# Altium project PCB_Project.PrjPcb
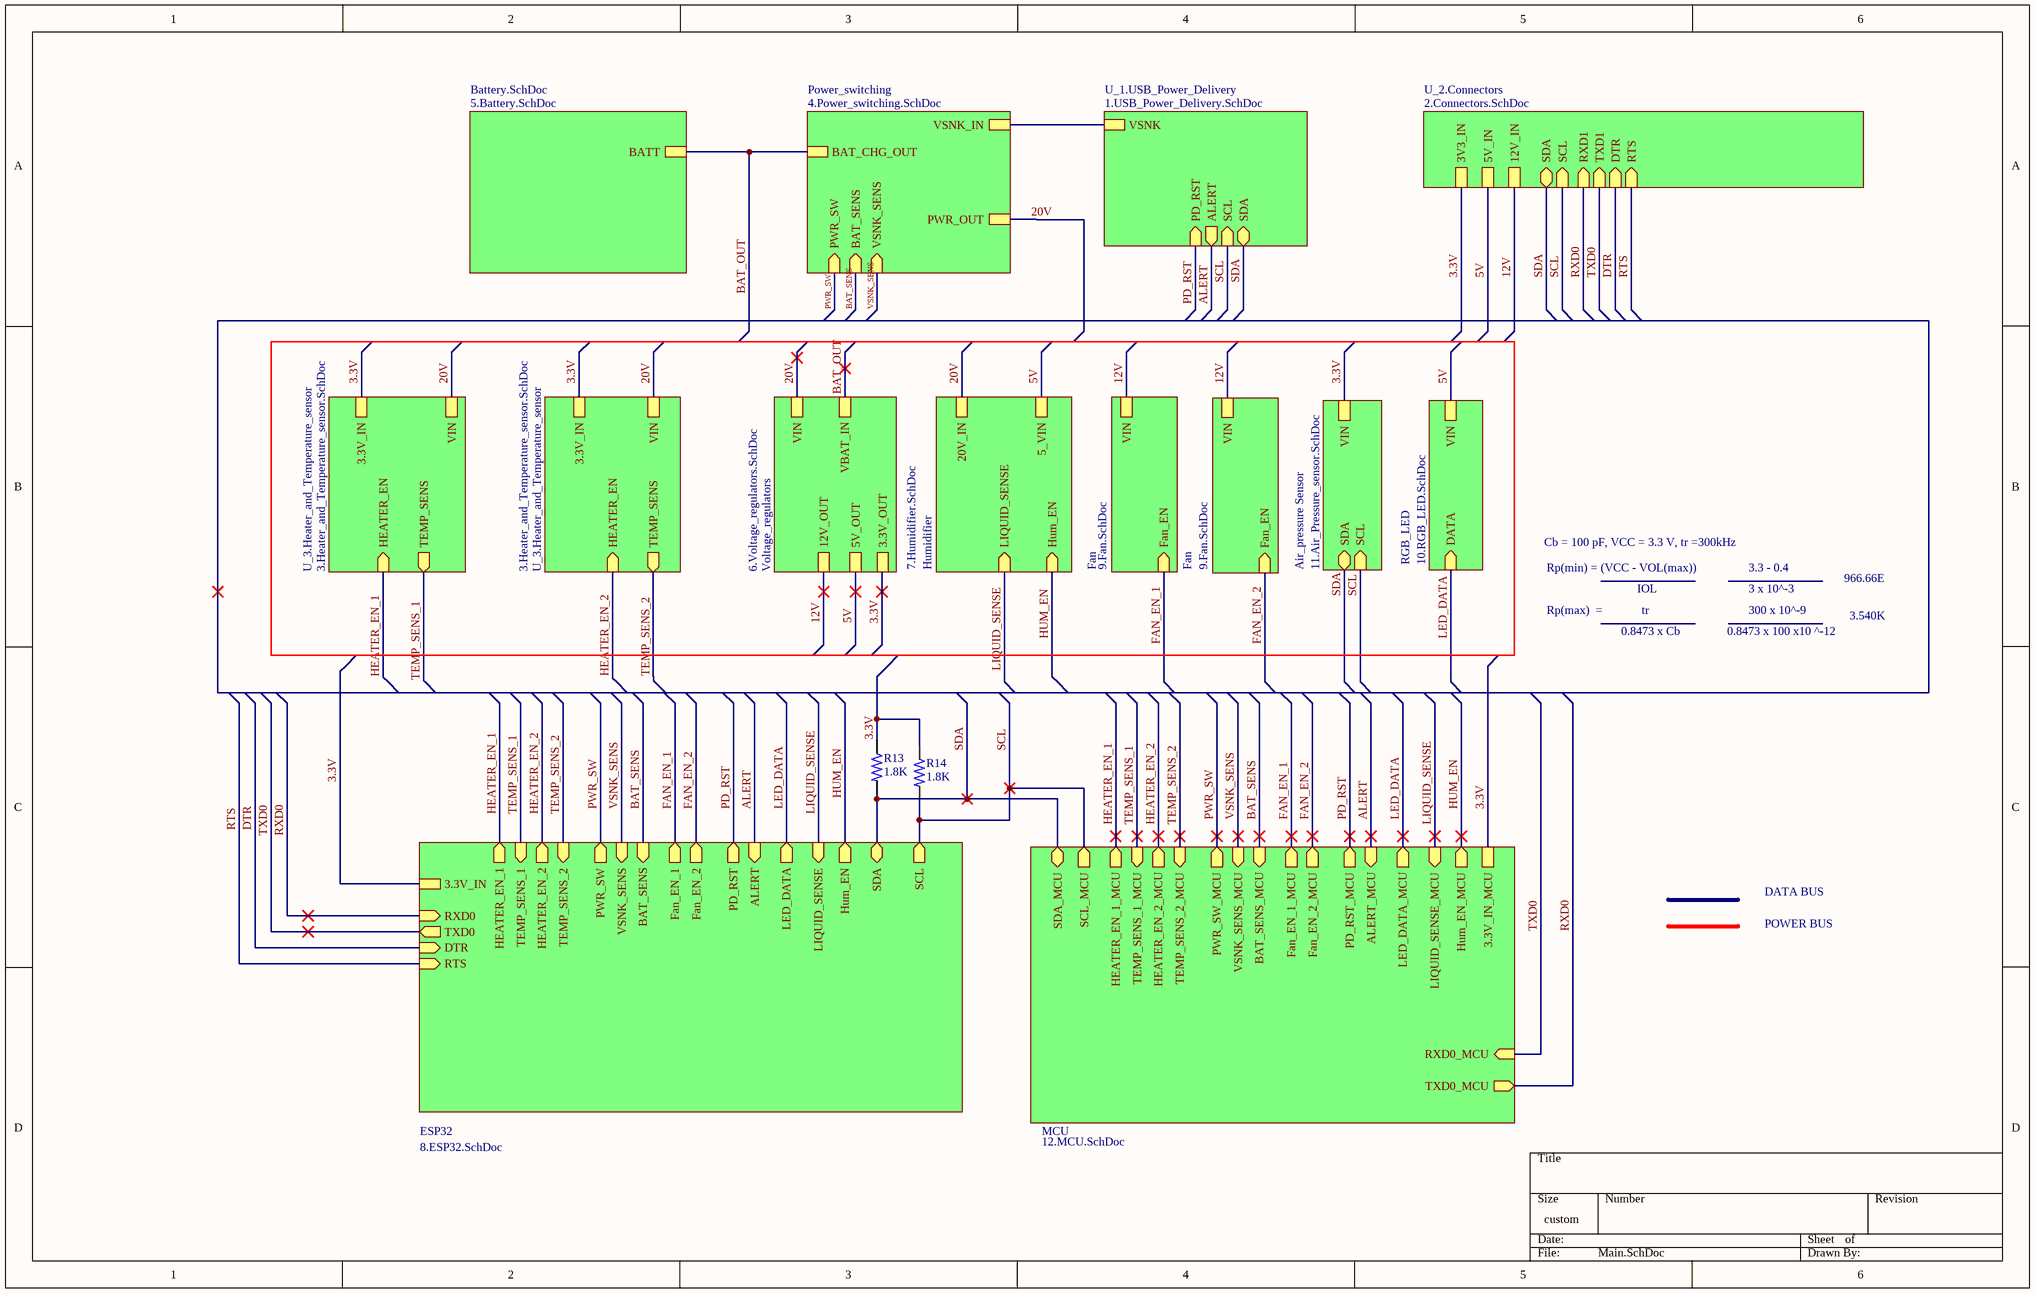
[diagram p0: Main.SchDoc]
13 sheets, 201 parts. Net scope: hierarchical (ports join the sheet entries above them; power ports are global).
Board file: PCB.PcbDoc
Sheets:
  Main.SchDoc
    U_1.USB_Power_Delivery = 1.USB_Power_Delivery.SchDoc
    U_2.Connectors = 2.Connectors.SchDoc
    U_3.Heater_and_Temperature_sensor = 3.Heater_and_Temperature_sensor.SchDoc
    U_3.Heater_and_Temperature_sensor = 3.Heater_and_Temperature_sensor.SchDoc
    Power_switching = 4.Power_switching.SchDoc
    Battery.SchDoc = 5.Battery.SchDoc
    Air_pressure Sensor = 11.Air_Pressure_sensor.SchDoc
    Humidifier = 7.Humidifier.SchDoc
    Fan = 9.Fan.SchDoc
    Voltage_regulators = 6.Voltage_regulators.SchDoc
    ESP32 = 8.ESP32.SchDoc
    RGB_LED = 10.RGB_LED.SchDoc
    Fan = 9.Fan.SchDoc
    MCU = 12.MCU.SchDoc

## Sheet Main.SchDoc
size 381 x 241 mm; SheetNumber: 1; SheetTotal: 13

### Parts
R13  1.8K  [R_0603]
R14  1.8K  [R_0603]

### Sub-sheets
Air_pressure Sensor = 11.Air_Pressure_sensor.SchDoc: VIN, SDA (bidir), SCL (in)
Battery.SchDoc = 5.Battery.SchDoc: BATT
ESP32 = 8.ESP32.SchDoc: SDA (bidir), SCL (out), 3.3V_IN, Hum_EN (out), RXD0 (in), TXD0 (out), DTR (in), RTS (in), HEATER_EN_1 (out), TEMP_SENS_1 (in), HEATER_EN_2 (out), TEMP_SENS_2 (in), LIQUID_SENSE (in), Fan_EN_1 (out), LED_DATA (out), Fan_EN_2 (out), PWR_SW (out), VSNK_SENS (in), BAT_SENS (in), PD_RST (out), ALERT (in)
Fan = 9.Fan.SchDoc: VIN, Fan_EN (in)
Fan = 9.Fan.SchDoc: VIN, Fan_EN (in)
Humidifier = 7.Humidifier.SchDoc: Hum_EN (in), 5_VIN, 20V_IN, LIQUID_SENSE (in)
MCU = 12.MCU.SchDoc: SDA_MCU (bidir), SCL_MCU (out), Hum_EN_MCU (out), HEATER_EN_2_MCU (out), TEMP_SENS_2_MCU (in), LIQUID_SENSE_MCU (in), Fan_EN_1_MCU (out), LED_DATA_MCU (out), Fan_EN_2_MCU (out), PWR_SW_MCU (out), VSNK_SENS_MCU (in), BAT_SENS_MCU (in), PD_RST_MCU (out), ALERT_MCU (in), RXD0_MCU (in), TXD0_MCU (out), 3.3V_IN_MCU, HEATER_EN_1_MCU (out), TEMP_SENS_1_MCU (in)
Power_switching = 4.Power_switching.SchDoc: PWR_OUT, VSNK_IN, BAT_CHG_OUT, PWR_SW (in), BAT_SENS (in), VSNK_SENS (in)
RGB_LED = 10.RGB_LED.SchDoc: DATA (in), VIN
U_1.USB_Power_Delivery = 1.USB_Power_Delivery.SchDoc: SDA (bidir), SCL (in), ALERT (out), PD_RST (in), VSNK
U_2.Connectors = 2.Connectors.SchDoc: SDA (bidir), SCL (in), RXD1 (in), TXD1 (in), DTR (in), RTS (in), 5V_IN, 3V3_IN, 12V_IN
U_3.Heater_and_Temperature_sensor = 3.Heater_and_Temperature_sensor.SchDoc: HEATER_EN (in), VIN, TEMP_SENS (out), 3.3V_IN
U_3.Heater_and_Temperature_sensor = 3.Heater_and_Temperature_sensor.SchDoc: HEATER_EN (in), VIN, TEMP_SENS (out), 3.3V_IN
Voltage_regulators = 6.Voltage_regulators.SchDoc: VIN, 3.3V_OUT, VBAT_IN, 5V_OUT, 12V_OUT

### Nets
3.3V: R13.1 R14.1 ; sheet U_2.Connectors/3V3_IN, sheet U_3.Heater_and_Temperature_sensor/3.3V_IN, sheet U_3.Heater_and_Temperature_sensor/3.3V_IN, sheet Air_pressure Sensor/VIN, sheet Voltage_regulators/3.3V_OUT, sheet ESP32/3.3V_IN, sheet MCU/3.3V_IN_MCU
5V: sheet U_2.Connectors/5V_IN, sheet Humidifier/5_VIN, sheet Voltage_regulators/5V_OUT, sheet RGB_LED/VIN
12V: sheet U_2.Connectors/12V_IN, sheet Fan/VIN, sheet Voltage_regulators/12V_OUT, sheet Fan/VIN
20V: sheet U_3.Heater_and_Temperature_sensor/VIN, sheet U_3.Heater_and_Temperature_sensor/VIN, sheet Power_switching/PWR_OUT, sheet Humidifier/20V_IN, sheet Voltage_regulators/VIN
ALERT: sheet U_1.USB_Power_Delivery/ALERT, sheet ESP32/ALERT, sheet MCU/ALERT_MCU
BAT_OUT: sheet Power_switching/BAT_CHG_OUT, sheet Battery.SchDoc/BATT, sheet Voltage_regulators/VBAT_IN
BAT_SENS: sheet Power_switching/BAT_SENS, sheet ESP32/BAT_SENS, sheet MCU/BAT_SENS_MCU
DTR: sheet U_2.Connectors/DTR, sheet ESP32/DTR
FAN_EN_1: sheet Fan/Fan_EN, sheet ESP32/Fan_EN_1, sheet MCU/Fan_EN_1_MCU
FAN_EN_2: sheet ESP32/Fan_EN_2, sheet Fan/Fan_EN, sheet MCU/Fan_EN_2_MCU
HEATER_EN_1: sheet U_3.Heater_and_Temperature_sensor/HEATER_EN, sheet ESP32/HEATER_EN_1, sheet MCU/HEATER_EN_1_MCU
HEATER_EN_2: sheet U_3.Heater_and_Temperature_sensor/HEATER_EN, sheet ESP32/HEATER_EN_2, sheet MCU/HEATER_EN_2_MCU
HUM_EN: sheet Humidifier/Hum_EN, sheet ESP32/Hum_EN, sheet MCU/Hum_EN_MCU
LED_DATA: sheet ESP32/LED_DATA, sheet RGB_LED/DATA, sheet MCU/LED_DATA_MCU
LIQUID_SENSE: sheet Humidifier/LIQUID_SENSE, sheet ESP32/LIQUID_SENSE, sheet MCU/LIQUID_SENSE_MCU
PD_RST: sheet U_1.USB_Power_Delivery/PD_RST, sheet ESP32/PD_RST, sheet MCU/PD_RST_MCU
PWR_SW: sheet Power_switching/PWR_SW, sheet ESP32/PWR_SW, sheet MCU/PWR_SW_MCU
RTS: sheet U_2.Connectors/RTS, sheet ESP32/RTS
RXD0: sheet U_2.Connectors/RXD1, sheet ESP32/RXD0, sheet MCU/TXD0_MCU
SCL: R14.2 ; sheet U_1.USB_Power_Delivery/SCL, sheet U_2.Connectors/SCL, sheet Air_pressure Sensor/SCL, sheet ESP32/SCL, sheet MCU/SCL_MCU
SDA: R13.2 ; sheet U_1.USB_Power_Delivery/SDA, sheet U_2.Connectors/SDA, sheet Air_pressure Sensor/SDA, sheet ESP32/SDA, sheet MCU/SDA_MCU
TEMP_SENS_1: sheet U_3.Heater_and_Temperature_sensor/TEMP_SENS, sheet ESP32/TEMP_SENS_1, sheet MCU/TEMP_SENS_1_MCU
TEMP_SENS_2: sheet U_3.Heater_and_Temperature_sensor/TEMP_SENS, sheet ESP32/TEMP_SENS_2, sheet MCU/TEMP_SENS_2_MCU
TXD0: sheet U_2.Connectors/TXD1, sheet ESP32/TXD0, sheet MCU/RXD0_MCU
VSNK_SENS: sheet Power_switching/VSNK_SENS, sheet ESP32/VSNK_SENS, sheet MCU/VSNK_SENS_MCU
NetJ1_2: sheet U_1.USB_Power_Delivery/VSNK, sheet Power_switching/VSNK_IN

### Notes on the sheet
- Cb = 100 pF, VCC = 3.3 V, tr =300kHz
- Rp(min) = (VCC - VOL(max))
- 3.3 - 0.4
- Rp(max)  =             tr
- 0.8473 x Cb
- IOL
- 0.8473 x 100 x10 ^-12
- 300 x 10^-9
- 3 x 10^-3
- 966.66E
- 3.540K
- DATA BUS
- POWER BUS

### Library data of the parts
R13 R14 = R_0603: D: *; MFR: *; P: *; PN: *; URL: *

## Sheet 1.USB_Power_Delivery.SchDoc
size B; ApprovedBy: Shijith Mohan; Author: Krishnawa; SheetNumber: 2; SheetTotal: 13
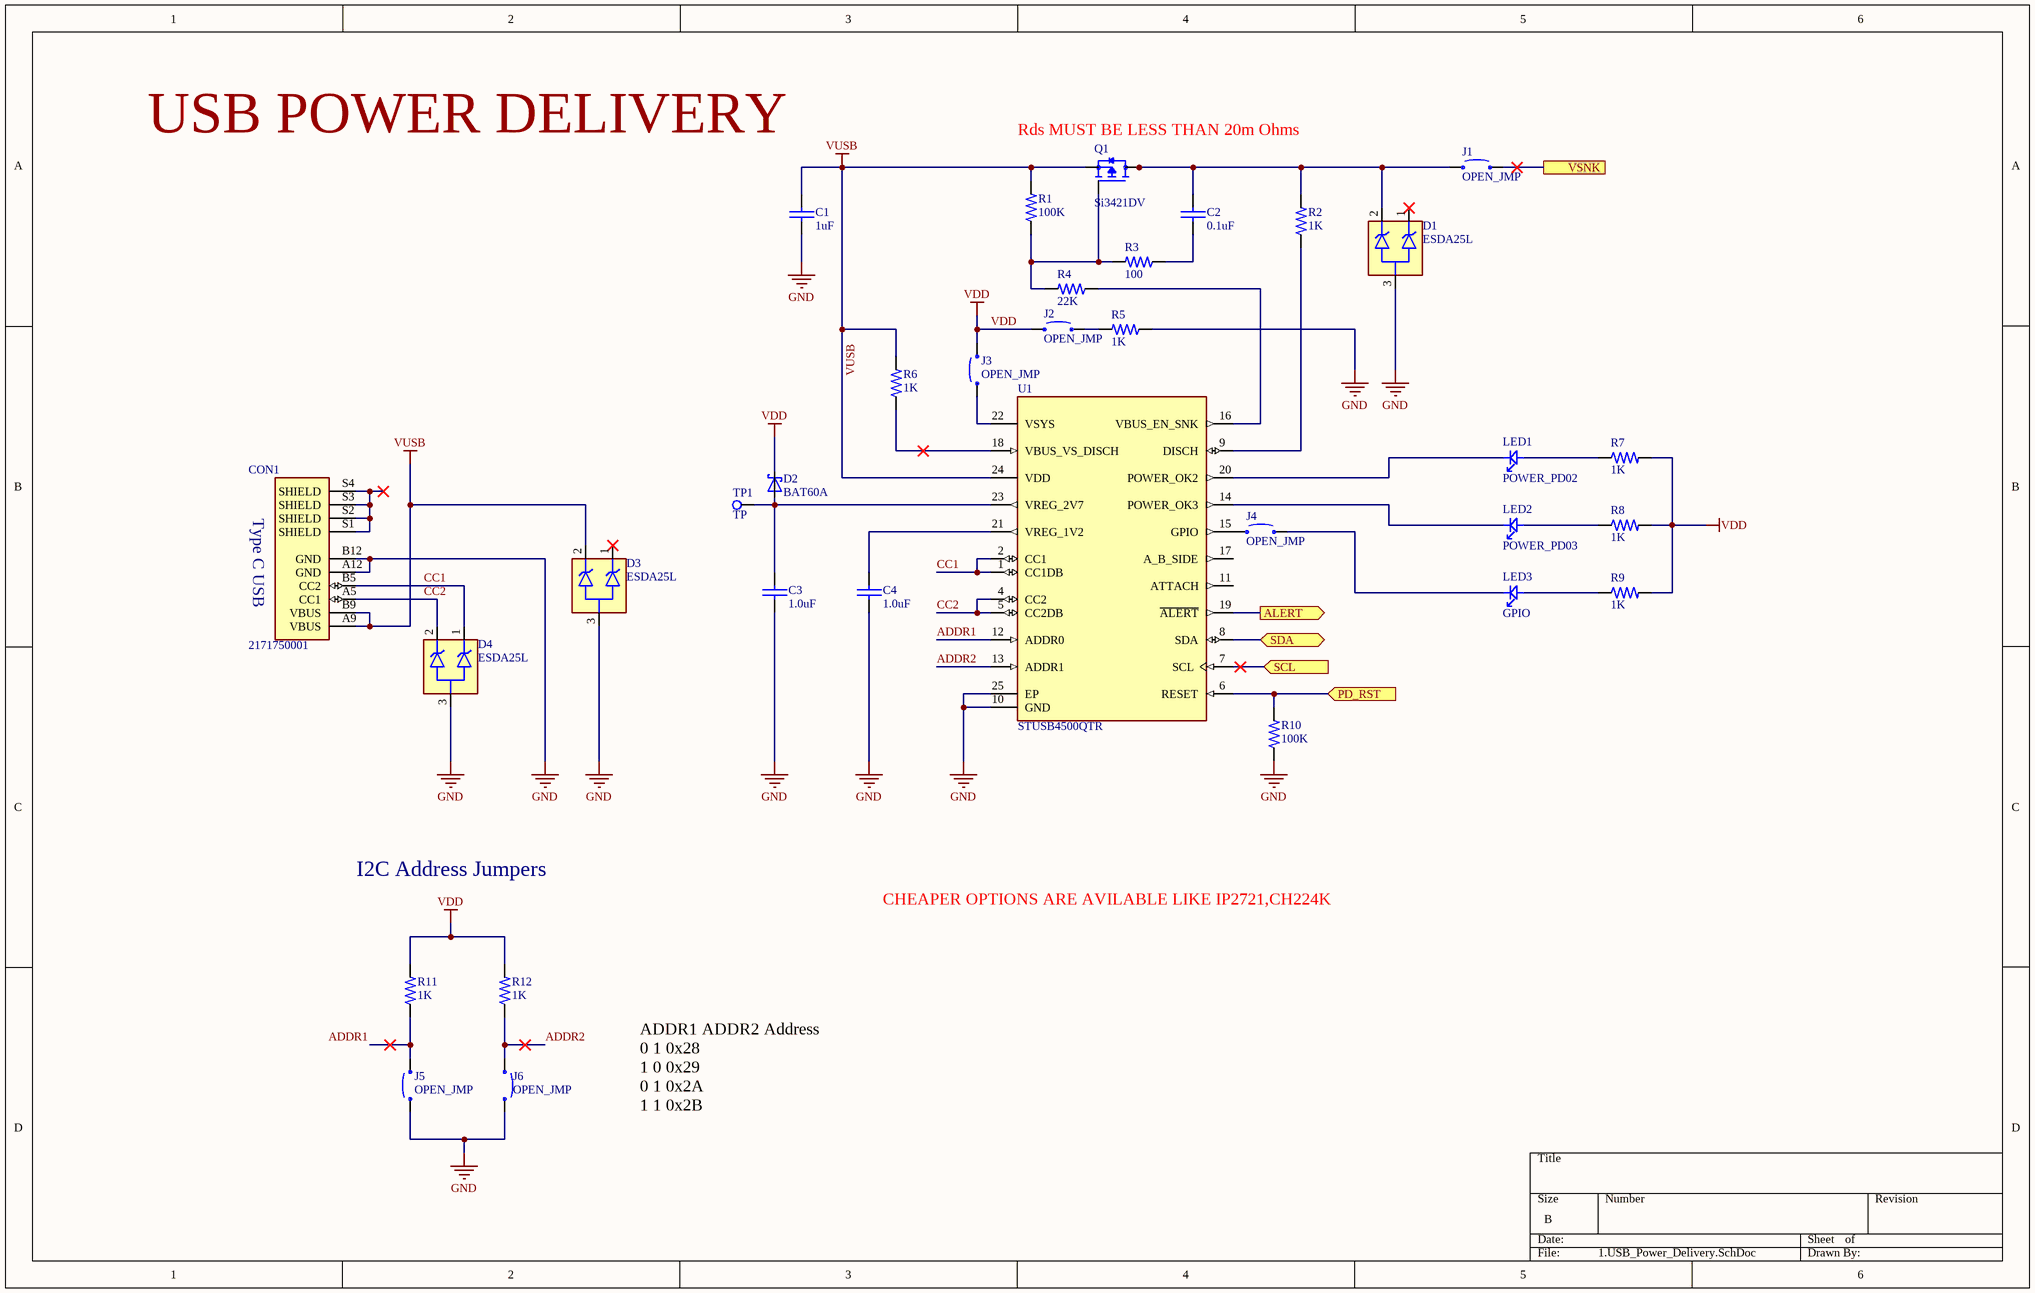
[diagram p1: 1.USB_Power_Delivery.SchDoc]

### Parts
C1  1uF  [C_0603]
C2  0.1uF  [C_0603]
C3  1.0uF  [C_0603]
C4  1.0uF  [C_0603]
CON1  2171750001  [217175-0001]
D1  ESDA25L  [SOT-23-3]
D2  BAT60A  [SOD-323]
D3  ESDA25L  [SOT-23-3]
D4  ESDA25L  [SOT-23-3]
J1  OPEN_JMP  [OPEN_JMP]
J2  OPEN_JMP  [OPEN_JMP]
J3  OPEN_JMP  [OPEN_JMP]
J4  OPEN_JMP  [OPEN_JMP]
J5  OPEN_JMP  [OPEN_JMP]
J6  OPEN_JMP  [OPEN_JMP]
LED1  POWER_PD02  [LED_0603]
LED2  POWER_PD03  [LED_0603]
LED3  GPIO  [LED_0603]
Q1  Si3421DV  [TSOP-6]
R1  100K  [R_0603]
R2  1K  [R_0603]
R3  100  [R_0603]
R4  22K  [R_0603]
R5  1K  [R_0603]
R6  1K  [R_0603]
R7  1K  [R_0603]
R8  1K  [R_0603]
R9  1K  [R_0603]
R10  100K  [R_0603]
R11  1K  [R_0603]
R12  1K  [R_0603]
TP1  TP  [TP]
U1  STUSB4500QTR  [VFQFN-24]

### Ports
ALERT (out), PD_RST (in), SCL (in), SDA (bidir), VSNK

### Nets
GND: C1.1 C3.1 C4.1 CON1.A12(GND) CON1.B12(GND) D1.3(CA) D3.3(CA) D4.3(CA) J5.1 J6.1 R5.1 R10.1 U1.10(GND) U1.25(EP)  [project net VSS]
VDD: D2.C J2.1 J3.2 R7.2 R8.2 R9.2 R11.2 R12.2
VUSB: C1.2 CON1.A9(VBUS) CON1.B9(VBUS) D3.2(C2) Q1.4(S) R1.2 R6.2 U1.24(VDD)
ADDR1: J5.2 R11.1 U1.12(ADDR0)
ADDR2: J6.2 R12.1 U1.13(ADDR1)
ALERT: U1.19(~{ALERT}) ; port ALERT
CC1: CON1.B5(CC2) D4.1(C1) U1.1(CC1DB) U1.2(CC1)
CC2: CON1.A5(CC1) D4.2(C2) U1.4(CC2) U1.5(CC2DB)
PD_RST: R10.2 U1.6(RESET) ; port PD_RST
SCL: U1.7(SCL) ; port SCL
SDA: U1.8(SDA) ; port SDA
NetC2_1: C2.1 R3.1
NetC2_2: C2.2 D1.2(C2) J1.1 Q1.1(D) Q1.2(D) Q1.5(D) Q1.6(D) R2.2
NetC3_2: C3.2 D2.A TP1.1 U1.23(VREG_2V7)
NetC4_2: C4.2 U1.21(VREG_1V2)
NetCON1_S1: CON1.S1(SHIELD) CON1.S2(SHIELD) CON1.S3(SHIELD) CON1.S4(SHIELD)
NetJ1_2: J1.2 ; port VSNK
NetJ2_2: J2.2 R5.2
NetJ3_1: J3.1 U1.22(VSYS)
NetJ4_1: J4.1 U1.15(GPIO)
NetJ4_2: J4.2 LED3.K
NetLED1_A: LED1.A R7.1
NetLED1_K: LED1.K U1.20(POWER_OK2)
NetLED2_A: LED2.A R8.1
NetLED2_K: LED2.K U1.14(POWER_OK3)
NetLED3_A: LED3.A R9.1
NetQ1_3: Q1.3(G) R1.1 R3.2 R4.2
NetR2_1: R2.1 U1.9(DISCH)
NetR4_1: R4.1 U1.16(VBUS_EN_SNK)
NetR6_1: R6.1 U1.18(VBUS_VS_DISCH)

Not connected (* = marked no-connect by the designer): D1 1(C1)*; D3 1(C1)*; U1 11(ATTACH) 17(A_B_SIDE)

### Notes on the sheet
- USB POWER DELIVERY
- (near Q1) Rds MUST BE LESS THAN 20m Ohms
- I2C Address Jumpers
- CHEAPER OPTIONS ARE AVILABLE LIKE IP2721,CH224K
- ADDR1	ADDR2	Address
  0	1	0x28
  1	0	0x29
  0	1	0x2A
  1	1	0x2B
- (in symbol 2171750001) Type C USB

### Library data of the parts
C1-C4 = C_0603: D: *; MFR: *; P: *; PN: *; URL: *
CON1 = 2171750001: MFR: Molex; D: USB Connectors Top-Mnt SMT 6Ckt Type C Rec.; P: 6 Contact; PN: 217175-0001; URL: https://www.mouser.in/ProductDetail/Molex/217175-0001?qs=DRkmTr78QARWJMiqNnldSg%3D%3D
D1 D3 D4 = ESDA25L: MFR: STMicroelectronics; D: ESD Suppressors / TVS Diodes SUPPRESSOR; P: SOT23-3L; PN: ESDA25L; URL: https://www.mouser.in/ProductDetail/STMicroelectronics/ESDA25L?qs=%252BFmDY%2FmH7IYTgvQLXlr24g%3D%3D
D2 = BAT60A: PN: BAT60AE6327HTSA1; D: Schottky Diodes & Rectifiers 10 V 3000 mA; P: SOD-323; URL: https://www.mouser.in/ProductDetail/Infineon-Technologies/BAT60AE6327HTSA1?qs=OwbwYO03UsIW3Y2lCXbs8Q%3D%3D
LED1-LED3 = LED_0603: MFR: Wurth Elektronik; PN: 150060RS75000; D: Standard LEDs - SMD WL-SMCW SMDMono TpVw Waterclr 0603 Red; P: 0603; YRL: https://www.mouser.in/ProductDetail/Wurth-Elektronik/150060RS75000?qs=LlUlMxKIyB3QnmZ3fw%2FVCA%3D%3D
Q1 = Si3421DV: MFR: Vishay Siliconix; D: P-Channel 30 V (D-S) MOSFET; PN: SI3421DV-T1-GE3; P: TSOP-6; URL: https://www.mouser.in/ProductDetail/Vishay-Semiconductors/SI3421DV-T1-GE3?qs=dpt6vIvaxwjvmZPXyyVpRg%3D%3D
R1-R12 = R_0603: D: *; MFR: *; P: *; PN: *; URL: *
U1 = STUSB4500QTR: MFR: STMicroelectronics; D: USB Interface IC Standalone USB PD controller for power sinking devices; P: QFN-24; PN: STUSB4500QTR; URL: https://www.mouser.in/ProductDetail/STMicroelectronics/STUSB4500QTR?qs=wUXugUrL1qyQbYMSzG1ujg%3D%3D&gclid=CjwKCAiA7IGcBhA8EiwAFfUDsZkZhe45H6sb259SlrXLDhHuC3iFilUbHdwuboXJa3yG6M-NUEA8VhoC06YQAvD_BwE

## Sheet 2.Connectors.SchDoc
size A4; SheetNumber: 3; SheetTotal: 13
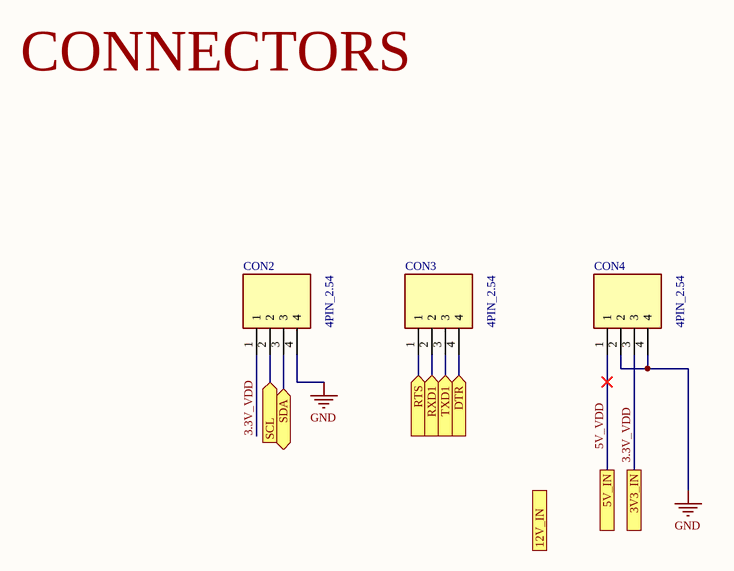
[diagram p2: 2.Connectors.SchDoc]

### Parts
CON2  4PIN_2.54  [4Pin_2.5]
CON3  4PIN_2.54  [4Pin_2.5]
CON4  4PIN_2.54  [4Pin_2.5]

### Ports
3V3_IN, 5V_IN, 12V_IN, DTR (in), RTS (in), RXD1 (in), SCL (in), SDA (bidir), TXD1 (in)

### Nets
GND: CON2.4 CON4.2 CON4.4  [project net VSS]
3.3V_VDD: CON2.1 CON4.3 ; port 3V3_IN  [project net 3.3V]
5V_VDD: CON4.1 ; port 5V_IN  [project net 5V]
DTR: CON3.4 ; port DTR
RTS: CON3.1 ; port RTS
RXD0: CON3.2 ; port RXD1
SCL: CON2.2 ; port SCL
SDA: CON2.3 ; port SDA
TXD0: CON3.3 ; port TXD1

### Notes on the sheet
- CONNECTORS

### Library data of the parts
CON2-CON4 = 4PIN_2.54: PN: 87224-4

## Sheet 3.Heater_and_Temperature_sensor.SchDoc
size A4; SheetNumber: 4; SheetTotal: 13
Used 2 times, as channels U_3.Heater_and_Temperature_sensor, U_3.Heater_and_Temperature_sensor. Parts and nets are listed once, with the designators drawn on the sheet.
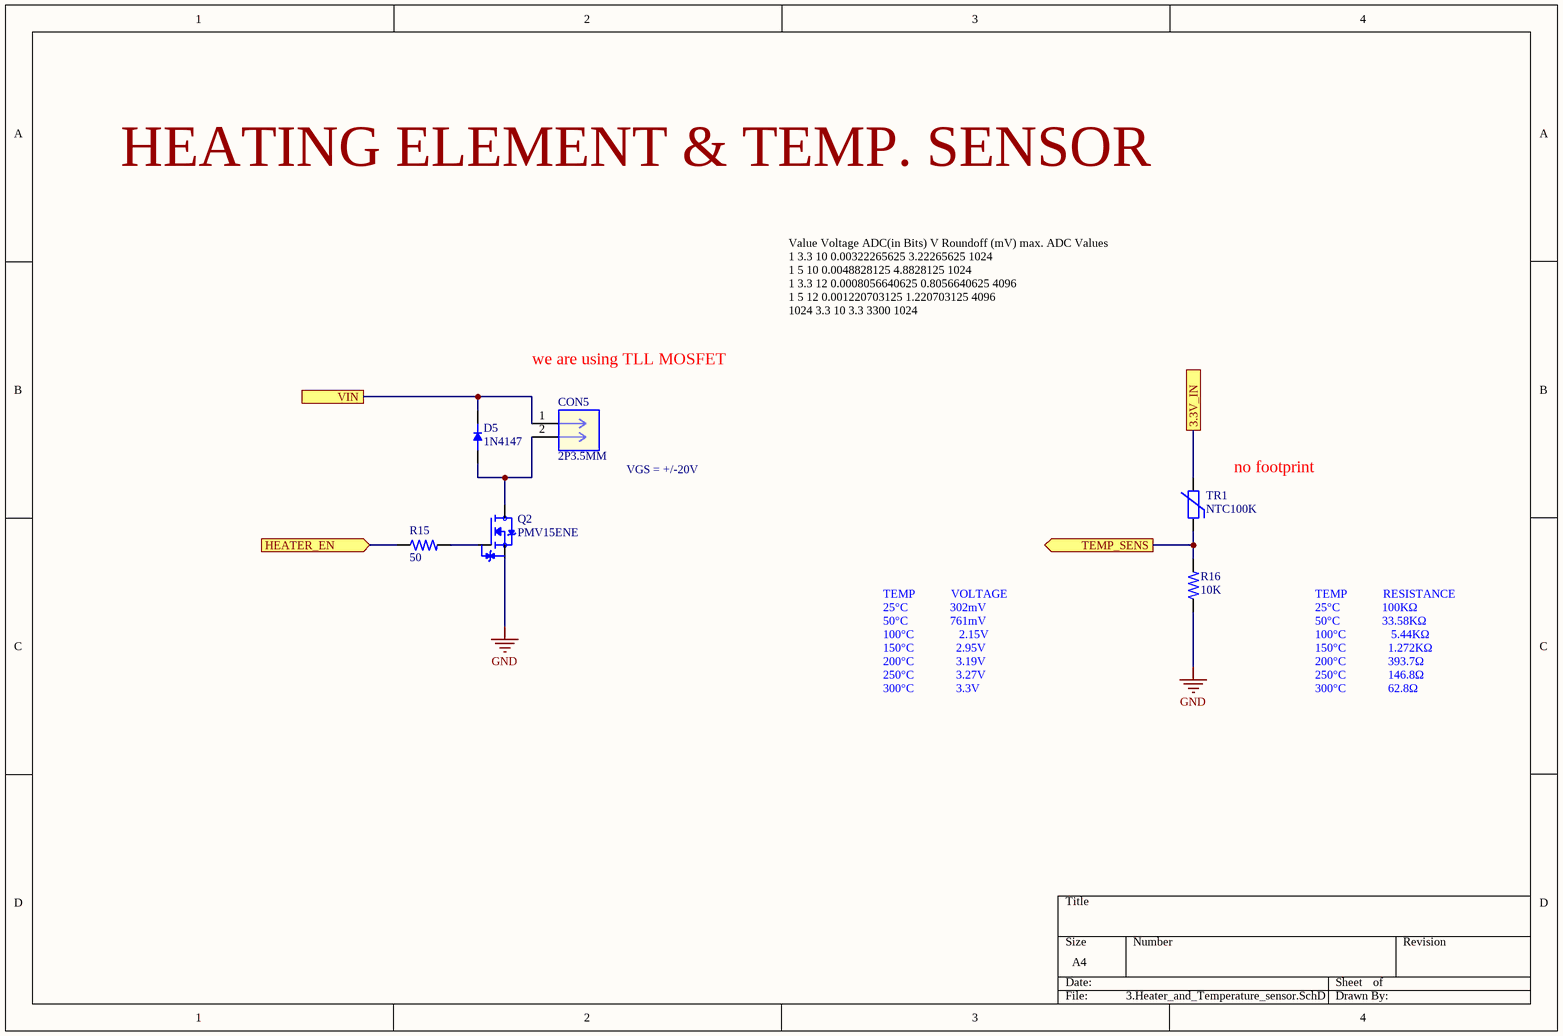
[diagram p3: 3.Heater_and_Temperature_sensor.SchDoc]

### Parts
CON5  2P3.5MM  [2P_P3.5mm]
D5  1N4147  [SOD123]
Q2  PMV15ENE  [SOT23FR]
R15  50  [R_0603]
R16  10K  [R_0603]
TR1  NTC100K

### Ports
3.3V_IN, HEATER_EN (in), TEMP_SENS (out), VIN

### Nets
GND: Q2.3(S) R16.1
3.3V_IN: TR1.1 ; port 3.3V_IN
HEATER_EN: R15.1 ; port HEATER_EN
TEMP_SENS: R16.2 TR1.2 ; port TEMP_SENS
VIN: CON5.1 D5.C(K) ; port VIN
NetCON5_2: CON5.2 D5.A Q2.1(D)
NetQ2_2: Q2.2(G) R15.2

### Channels
U_3.Heater_and_Temperature_sensor: designators end in A; ports 3.3V_IN=3.3V HEATER_EN=HEATER_EN_1 TEMP_SENS=TEMP_SENS_1 VIN=20V
U_3.Heater_and_Temperature_sensor: designators end in B; ports 3.3V_IN=3.3V HEATER_EN=HEATER_EN_2 TEMP_SENS=TEMP_SENS_2 VIN=20V

### Notes on the sheet
- HEATING ELEMENT & TEMP. SENSOR
- we are using TLL MOSFET
- Value	Voltage	ADC(in Bits)	V	Roundoff (mV)	max. ADC Values
  1	3.3	10	0.00322265625	3.22265625	1024
  1	5	10	0.0048828125	4.8828125	1024
  1	3.3	12	0.0008056640625	0.8056640625	4096
  1	5	12	0.001220703125	1.220703125	4096
  1024	3.3	10	3.3	3300	1024
- VGS = +/-20V
- (near TR1) no footprint
- TEMP	           VOLTAGE
  25°C	             302mV
  50°C	             761mV
  100°C 	             2.15V
  150°C	             2.95V
  200°C	             3.19V
  250°C	             3.27V
  300°C	             3.3V
- TEMP	           RESISTANCE
  25°C	             100KΩ
  50°C	             33.58KΩ
  100°C 	             5.44KΩ
  150°C	             1.272KΩ
  200°C	             393.7Ω
  250°C	             146.8Ω
  300°C	             62.8Ω

### Library data of the parts
CON5 = 2P3.5MM: MFR: Molex; D: Headers & Wire Housings 2CKT 3.5MM W TO B C KT 3.5MM W TO B CONN; PN: 53258-0229; URL: https://www.mouser.in/ProductDetail/Molex/53258-0229?qs=yYVs2tXBqMMxmAbgTccg5w%3D%3D
D5 = 1N4147: MFR: Panjit; PN: 1N4148W_R2_00001; D: Diodes - General Purpose, Power, Switching SURFACE MOUNT SWITCHING DIODES; P: SOD123; URL: https://www.mouser.in/ProductDetail/Panjit/1N4148W_R2_00001?qs=sPbYRqrBIVlsNrvmMQOkFA%3D%3D
Q2 = PMV15ENE: MFR: Nexperia; P: SOT-23-3; PN: PMV15ENER; D: MOSFET PMV15ENE/SOT23/TO-236AB; URL: https://www.mouser.in/ProductDetail/Nexperia/PMV15ENER?qs=Li%252BoUPsLEntpTHKsialBmQ%3D%3D
R15 R16 = R_0603: D: *; MFR: *; P: *; PN: *; URL: *
TR1 = NTC100K: MFR: Bussmann / Eaton; PN: NRBG105J4200B1J; D: NTC (Negative Temperature Coefficient) Thermistors Single ended, Glass NTC, 100K ohm, 4200 B; P: 2.54mm; URL: https://www.mouser.in/ProductDetail/Bussmann-Eaton/NRBG105J4200B1J?qs=doiCPypUmgEX7C7T9ljJrw%3D%3D

## Sheet 4.Power_switching.SchDoc
size A4; SheetNumber: 5; SheetTotal: 13
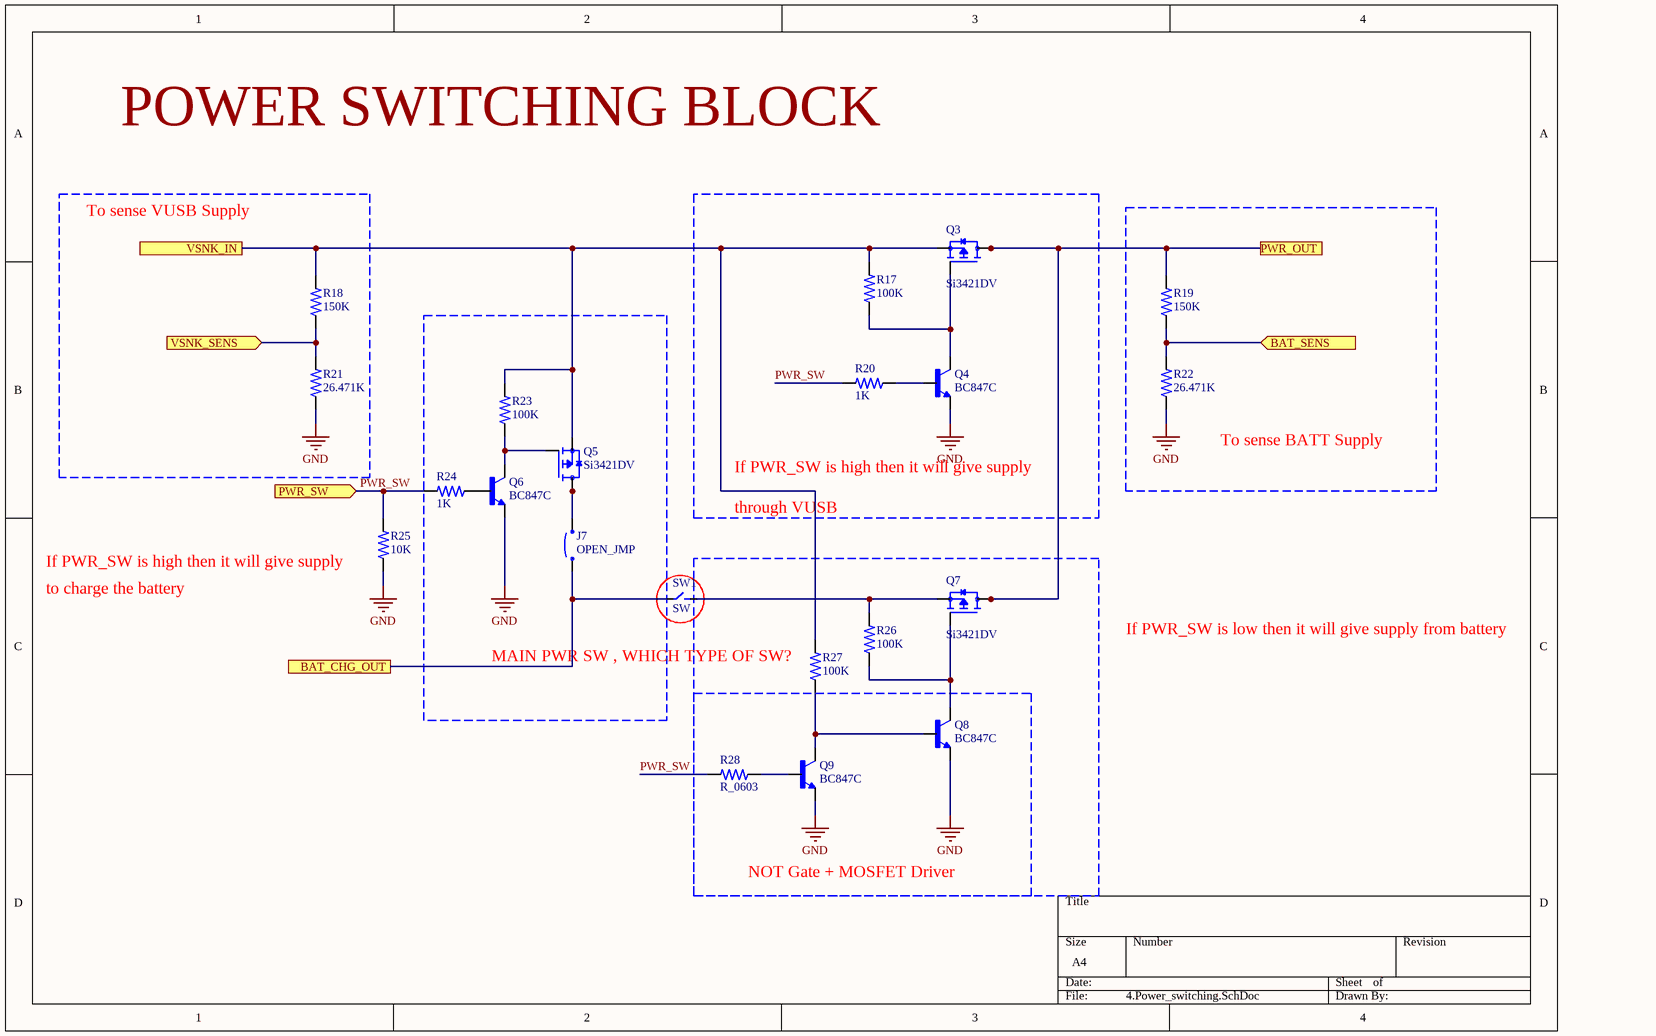
[diagram p4: 4.Power_switching.SchDoc]

### Parts
J7  OPEN_JMP  [OPEN_JMP]
Q3  Si3421DV  [TSOP-6]
Q4  BC847C  [SOT-23-3]
Q5  Si3421DV  [TSOP-6]
Q6  BC847C  [SOT-23-3]
Q7  Si3421DV  [TSOP-6]
Q8  BC847C  [SOT-23-3]
Q9  BC847C  [SOT-23-3]
R17  100K  [R_0603]
R18  150K  [R_0603]
R19  150K  [R_0603]
R20  1K  [R_0603]
R21  26.471K  [R_0603]
R22  26.471K  [R_0603]
R23  100K  [R_0603]
R24  1K  [R_0603]
R25  10K  [R_0603]
R26  100K  [R_0603]
R27  100K  [R_0603]
R28  R_0603  [R_0603]
SW1  SW

### Blocks framed on the sheet
To sense VUSB Supply: R18 R21
To sense BATT Supply: R19 R22
MAIN PWR SW , WHICH TYPE OF SW?: J7 Q5 Q6 R23 R24
NOT Gate + MOSFET Driver: Q8 Q9 R28

### Ports
BAT_CHG_OUT, BAT_SENS (in), PWR_OUT, PWR_SW (in), VSNK_IN, VSNK_SENS (in)

### Nets
GND: Q4.2(E) Q6.2(E) Q8.2(E) Q9.2(E) R21.1 R22.1 R25.1  [project net VSS]
20V: Q3.1(D) Q3.2(D) Q3.5(D) Q3.6(D) Q7.1(D) Q7.2(D) Q7.5(D) Q7.6(D) R19.2 ; port PWR_OUT
BAT_OUT: J7.1 SW1.1 ; port BAT_CHG_OUT
BAT_SENS: R19.1 R22.2 ; port BAT_SENS
PWR_SW: R20.2 R24.2 R25.2 R28.2 ; port PWR_SW
VSNK_SENS: R18.1 R21.2 ; port VSNK_SENS
NetJ1_2: Q3.4(S) Q5.4(S) R17.2 R18.2 R23.2 R27.2 ; port VSNK_IN
NetJ7_2: J7.2 Q5.1(D) Q5.2(D) Q5.5(D) Q5.6(D)
NetQ3_3: Q3.3(G) Q4.3(C) R17.1
NetQ4_1: Q4.1(B) R20.1
NetQ5_3: Q5.3(G) Q6.3(C) R23.1
NetQ6_1: Q6.1(B) R24.1
NetQ7_3: Q7.3(G) Q8.3(C) R26.1
NetQ7_4: Q7.4(S) R26.2 SW1.2
NetQ8_1: Q8.1(B) Q9.3(C) R27.1
NetQ9_1: Q9.1(B) R28.1

### Notes on the sheet
- POWER SWITCHING BLOCK
- If PWR_SW is high then it will give supply
- through VUSB
- (near R25) If PWR_SW is high then it will give supply
- to charge the battery
- If PWR_SW is low then it will give supply from battery

### Library data of the parts
Q3 Q5 Q7 = Si3421DV: as Q1 on sheet 1.USB_Power_Delivery; P: TSOP-6; URL: https://www.mouser.in/ProductDetail/Vishay-Semiconductors/SI3421DV-T1-GE3?qs=dpt6vIvaxwjvmZPXyyVpRg%3D%3D
Q4 Q6 Q8 Q9 = BC847C: MFR: Nexperia; D: Bipolar Transistors - BJT BC847C/SOT23/TO-236AB; PN: BC847C,215; P: SOT-23-3; URL: https://www.mouser.in/ProductDetail/Nexperia/BC847C215?qs=me8TqzrmIYVnv3C18%2Fxa3Q%3D%3D
R17-R27 = R_0603: D: *; MFR: *; P: *; PN: *; URL: *
R28 = R_0603: D: *; MFR: *; P: *; PN: *; URL: *

## Sheet 5.Battery.SchDoc
size A4; SheetNumber: 6; SheetTotal: 13
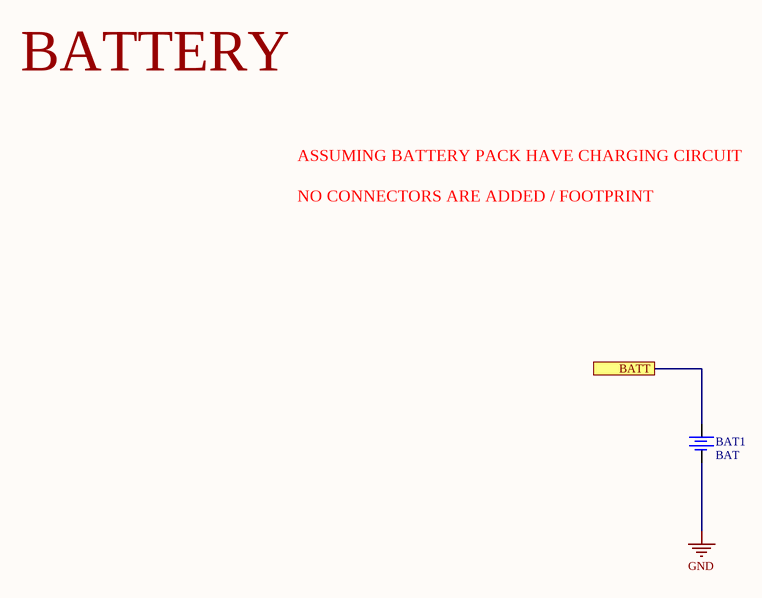
[diagram p5: 5.Battery.SchDoc]

### Parts
BAT1  BAT  [2P5mm_PITCH_COM]

### Ports
BATT

### Nets
GND: BAT1.1  [project net VSS]
BAT_OUT: BAT1.2 ; port BATT

### Notes on the sheet
- BATTERY
- ASSUMING BATTERY PACK HAVE CHARGING CIRCUIT
- NO CONNECTORS ARE ADDED / FOOTPRINT

## Sheet 11.Air_Pressure_sensor.SchDoc
size A4; SheetNumber: 12; SheetTotal: 13
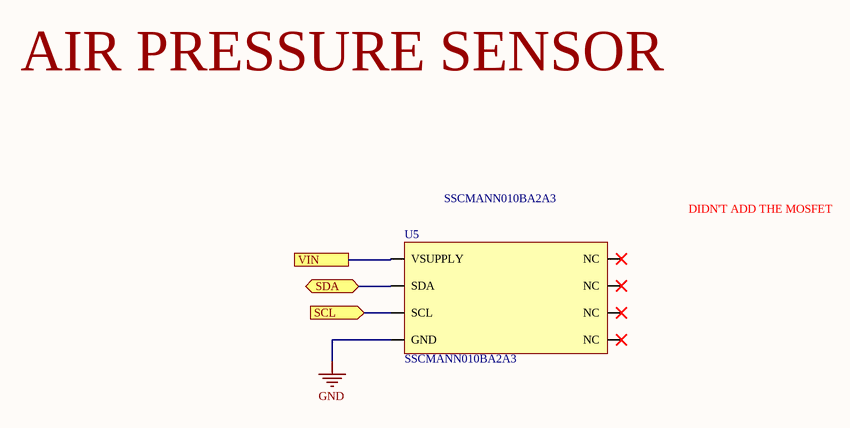
[diagram p6: 11.Air_Pressure_sensor.SchDoc]

### Parts
U5  SSCMANN010BA2A3  [SSCMANN010BA2A3]

### Ports
SCL (in), SDA (bidir), VIN

### Nets
GND: U5.1(GND)  [project net VSS]
3.3V: U5.2(VSUPPLY) ; port VIN
SCL: U5.4(SCL) ; port SCL
SDA: U5.3(SDA) ; port SDA

Not connected (* = marked no-connect by the designer): U5 5(NC)* 6(NC)* 7(NC)* 8(NC)*

### Notes on the sheet
- AIR PRESSURE SENSOR
- (near U5) SSCMANN010BA2A3
- DIDN'T ADD THE MOSFET

### Library data of the parts
U5 = SSCMANN010BA2A3: MFR: HONEYWELL; D: Board Mount Pressure Sensors; PN: SSCMANN010BA2A3; URL: https://www.mouser.in/ProductDetail/Honeywell/SSCMANN010BA2A3?qs=V2VaM7qhK8cLhmuNijeOKA%3D%3D

## Sheet 7.Humidifier.SchDoc
size A4; SheetNumber: 8; SheetTotal: 13
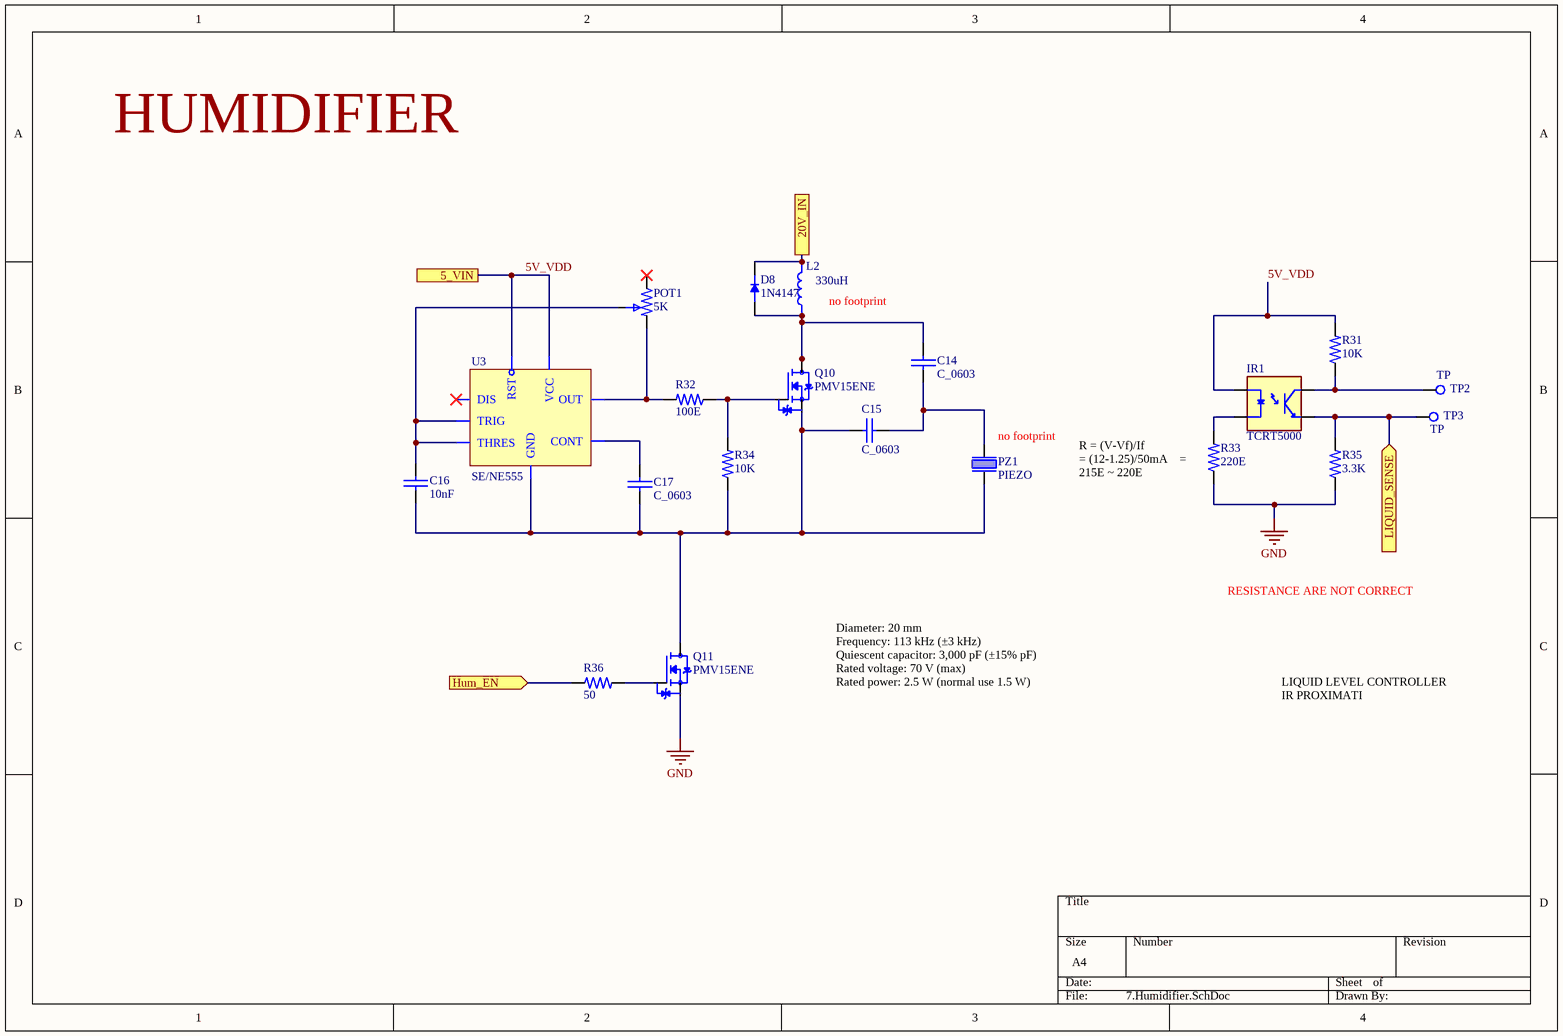
[diagram p7: 7.Humidifier.SchDoc]

### Parts
C14  C_0603  [C_0603]
C15  C_0603  [C_0603]
C16  10nF  [C_0603]
C17  C_0603  [C_0603]
D8  1N4147  [SOD123]
IR1  TCRT5000  [TCRT5000]
L2  330uH  [2P5mm_PITCH_COM]
POT1  5K  [TC33 - 3 mm SMD Trimpot]
PZ1  PIEZO  [2P5mm_PITCH_COM]
Q10  PMV15ENE  [SOT23FR]
Q11  PMV15ENE  [SOT23FR]
R31  10K  [R_0603]
R32  100E  [R_0603]
R33  220E  [R_0603]
R34  10K  [R_0603]
R35  3.3K  [R_0603]
R36  50  [R_0603]
TP2  TP
TP3  TP
U3  SE/NE555  [SOIC-8]

### Ports
5_VIN, 20V_IN, Hum_EN (in), LIQUID_SENSE (in)

### Nets
GND: Q11.3(S) R33.1 R35.1  [project net VSS]
5V_VDD: IR1.A R31.2 U3.4(RST) U3.8(VCC) ; port 5_VIN  [project net 5V]
20V: D8.C(K) L2.2 ; port 20V_IN
HUM_EN: R36.1 ; port Hum_EN
LIQUID_SENSE: IR1.E R35.2 TP3.1 ; port LIQUID_SENSE
NetC14_1: C14.1 C15.1 PZ1.2
NetC14_2: C14.2 D8.A L2.1 Q10.1(D)
NetC15_2: C15.2 C16.1 C17.1 PZ1.1 Q10.3(S) Q11.1(D) R34.1 U3.1(GND)
NetC16_2: C16.2 POT1.2(W) U3.2(TRIG) U3.6(THRES)
NetC17_2: C17.2 U3.5(CONT)
NetIR1_CATH: IR1.CATH R33.2
NetIR1_COLL: IR1.COLL R31.1 TP2.1
NetPOT1_3: POT1.3(CW) R32.2 U3.3(OUT)
NetQ10_2: Q10.2(G) R32.1 R34.2
NetQ11_2: Q11.2(G) R36.2

Not connected (* = marked no-connect by the designer): POT1 1(CCW)*; U3 7(DIS)*

### Notes on the sheet
- HUMIDIFIER
- (near L2) no footprint
- (near PZ1) no footprint
- (near R33) R = (V-Vf)/If             = (12-1.25)/50mA    = 215E ~ 220E
- RESISTANCE ARE NOT CORRECT
- Diameter: 20 mm
  Frequency: 113 kHz (±3 kHz)
  Quiescent capacitor: 3,000 pF (±15% pF)
  Rated voltage: 70 V (max)
  Rated power: 2.5 W (normal use 1.5 W)
- LIQUID LEVEL CONTROLLER   IR PROXIMATI

### Library data of the parts
C16 = C_0603: D: *; MFR: *; P: *; PN: *; URL: *
D8 = 1N4147: as D5 on sheet 3.Heater_and_Temperature_sensor; P: SOD123; URL: https://www.mouser.in/ProductDetail/Panjit/1N4148W_R2_00001?qs=sPbYRqrBIVlsNrvmMQOkFA%3D%3D
IR1 = TCRT5000: MFR: Vishay Semiconductors; D: Optical Switches, Reflective, Phototransistor; PN: TCRT5000L; P: *; URL: https://www.mouser.in/ProductDetail/Vishay-Semiconductors/TCRT5000L?qs=%2Fjqivxn91cdBAizhsWilRQ%3D%3D
L2 = L_COM
POT1 = TC33 - 3 mm SMD Trimpot: MFR: Bourns; D: Trimmer Resistors - SMD 3MM 5KOHMS 25% 0.1WATT OPEN FRM; P: SMD; PN: TC33X-2-502E; URL: https://www.mouser.in/ProductDetail/Bourns/TC33X-2-502E?qs=r%252B5EJQndA0pTgyiJsDuA%252BA%3D%3D
Q10 Q11 = PMV15ENE: as Q2 on sheet 3.Heater_and_Temperature_sensor; URL: https://www.mouser.in/ProductDetail/Nexperia/PMV15ENER?qs=Li%252BoUPsLEntpTHKsialBmQ%3D%3D
R31-R36 = R_0603: D: *; MFR: *; P: *; PN: *; URL: *
U3 = SE/NE555: MFR: Diodes Incorporated; D: Timers & Support Products Automotive Grade Precision Timer; PN: SE555QS-13; P: SOIC-8; URL: https://www.mouser.in/ProductDetail/Diodes-Incorporated/SE555QS-13?qs=MHUP4w%2FlnDyIUxZVHd9p8w%3D%3D
C14 C15 C17 = C_0603: D: *; MFR: *; P: *; PN: *; URL: *

## Sheet 9.Fan.SchDoc
size A4; SheetNumber: 10; SheetTotal: 13
Used 2 times, as channels Fan, Fan. Parts and nets are listed once, with the designators drawn on the sheet.
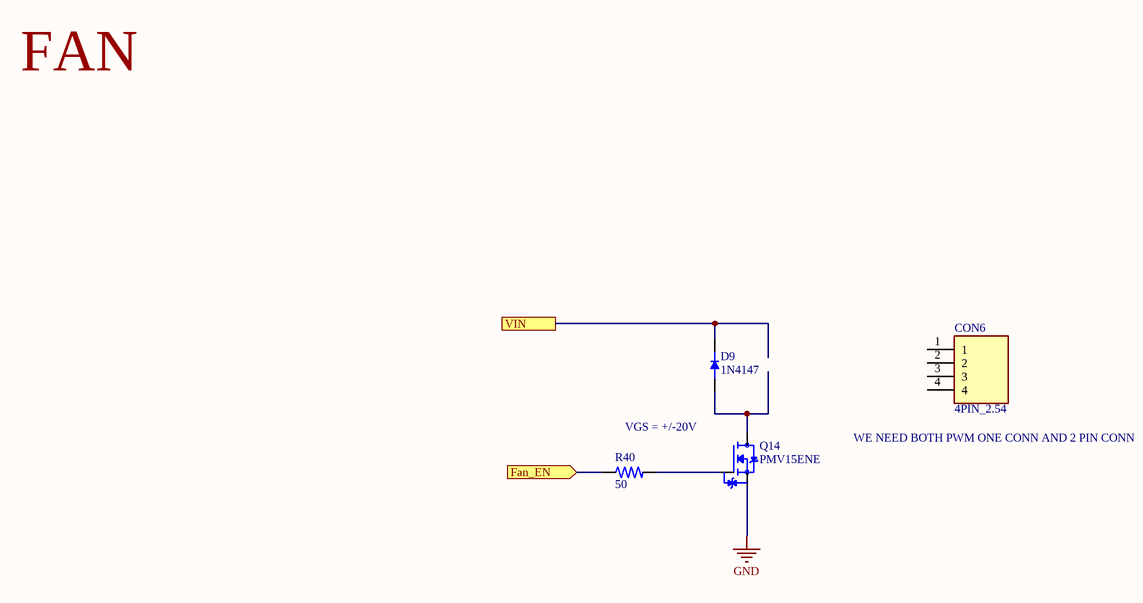
[diagram p8: 9.Fan.SchDoc]

### Parts
CON6  4PIN_2.54  [4Pin_2.5]
D9  1N4147  [SOD123]
Q14  PMV15ENE  [SOT23FR]
R40  50  [R_0603]

### Ports
Fan_EN (in), VIN

### Nets
GND: Q14.3(S)
Fan_EN: R40.1 ; port Fan_EN
VIN: D9.C(K) ; port VIN
NetD9_A: D9.A Q14.1(D)
NetQ14_2: Q14.2(G) R40.2

Not connected (* = marked no-connect by the designer): CON6 1 2 3 4

### Channels
Fan: designators end in A; ports Fan_EN=FAN_EN_1 VIN=12V
Fan: designators end in B; ports Fan_EN=FAN_EN_2 VIN=12V

### Notes on the sheet
- FAN
- VGS = +/-20V
- (near CON6) WE NEED BOTH PWM ONE CONN AND 2 PIN CONN

### Library data of the parts
CON6 = 4PIN_2.54: PN: 87224-4
D9 = 1N4147: as D5 on sheet 3.Heater_and_Temperature_sensor; P: SOD123; URL: https://www.mouser.in/ProductDetail/Panjit/1N4148W_R2_00001?qs=sPbYRqrBIVlsNrvmMQOkFA%3D%3D
Q14 = PMV15ENE: as Q2 on sheet 3.Heater_and_Temperature_sensor; URL: https://www.mouser.in/ProductDetail/Nexperia/PMV15ENER?qs=Li%252BoUPsLEntpTHKsialBmQ%3D%3D
R40 = R_0603: D: *; MFR: *; P: *; PN: *; URL: *

## Sheet 6.Voltage_regulators.SchDoc
size A3; SheetNumber: 7; SheetTotal: 13
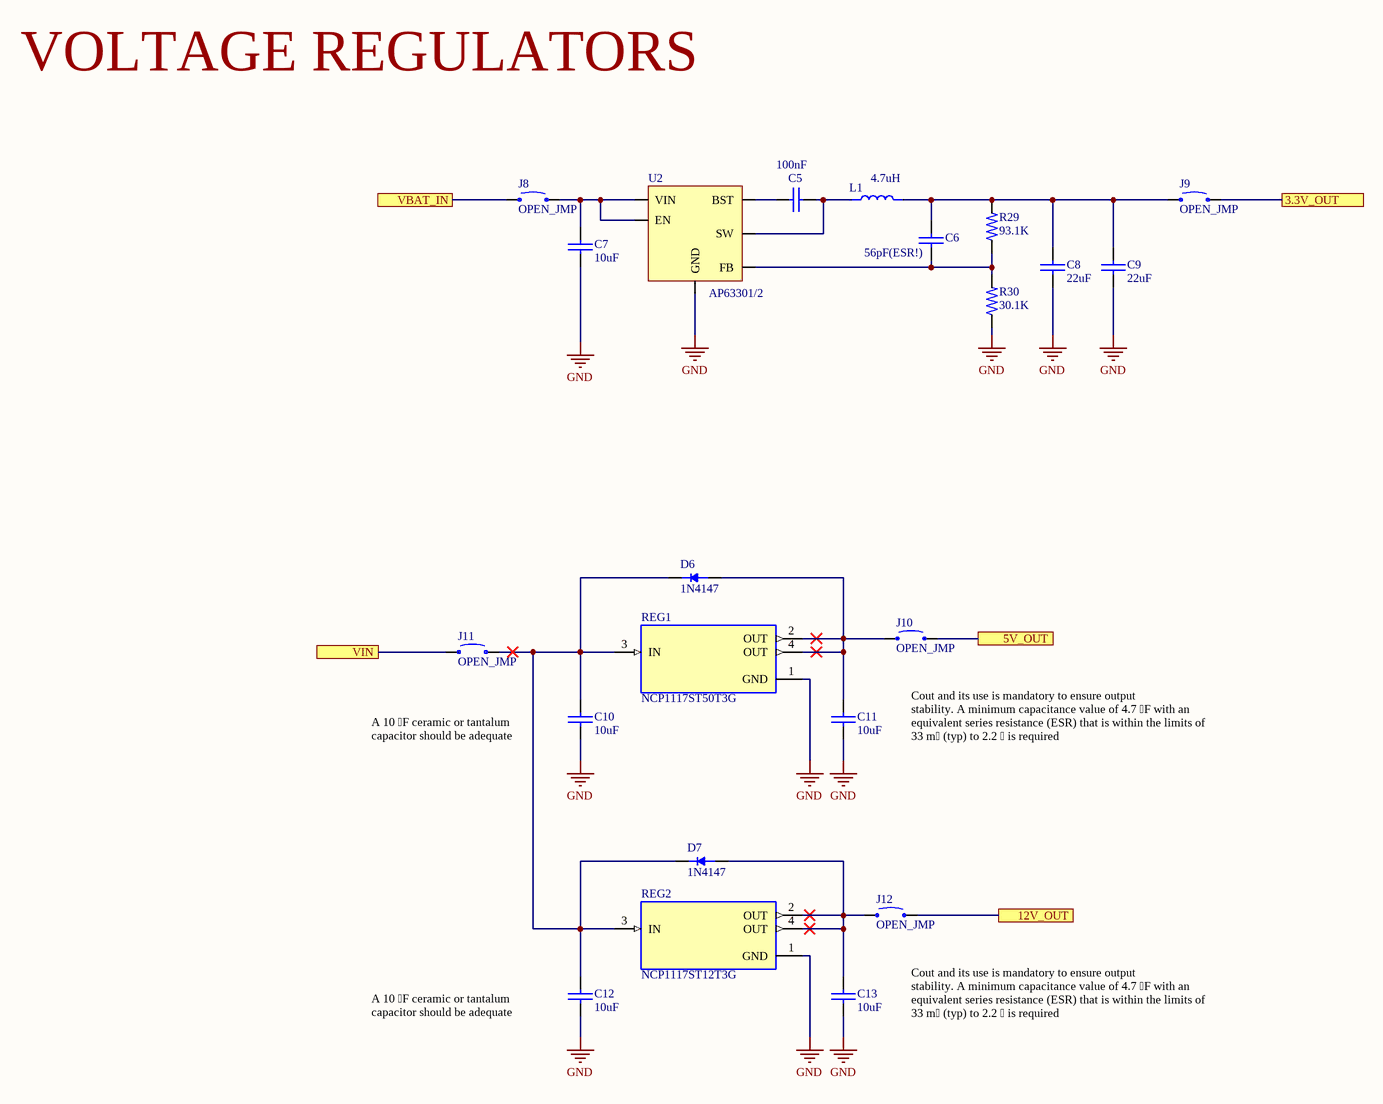
[diagram p9: 6.Voltage_regulators.SchDoc]

### Parts
C5  100nF  [C_0603]
C6  56pF(ESR!)  [C_0603]
C7  10uF  [C_0603]
C8  22uF  [C_0603]
C9  22uF  [C_0603]
C10  10uF  [C_0603]
C11  10uF  [C_0603]
C12  10uF  [C_0603]
C13  10uF  [C_0603]
D6  1N4147  [SOD123]
D7  1N4147  [SOD123]
J8  OPEN_JMP  [OPEN_JMP]
J9  OPEN_JMP  [OPEN_JMP]
J10  OPEN_JMP  [OPEN_JMP]
J11  OPEN_JMP  [OPEN_JMP]
J12  OPEN_JMP  [OPEN_JMP]
L1  4.7uH
R29  93.1K  [R_0603]
R30  30.1K  [R_0603]
REG1  NCP1117ST50T3G  [SOT-223]
REG2  NCP1117ST12T3G  [SOT-223]
U2  AP63301/2  [SOT-23-6]

### Ports
3.3V_OUT, 5V_OUT, 12V_OUT, VBAT_IN, VIN

### Nets
GND: C7.1 C8.1 C9.1 C10.1 C11.1 C12.1 C13.1 R30.1 REG1.1(GND) REG2.1(GND) U2.4(GND)  [project net VSS]
3.3V: J9.2 ; port 3.3V_OUT
5V: J10.2 ; port 5V_OUT
12V: J12.2 ; port 12V_OUT
20V: J11.1 ; port VIN
BAT_OUT: J8.1 ; port VBAT_IN
NetC5_1: C5.1 U2.6(BST)
NetC5_2: C5.2 L1.1 U2.5(SW)
NetC6_1: C6.1 R29.1 R30.2 U2.1(FB)
NetC6_2: C6.2 C8.2 C9.2 J9.1 L1.2 R29.2
NetC7_2: C7.2 J8.2 U2.2(EN) U2.3(VIN)
NetC10_2: C10.2 C12.2 D6.C(K) D7.C(K) J11.2 REG1.3(IN) REG2.3(IN)
NetC11_2: C11.2 D6.A J10.1 REG1.2(OUT) REG1.4(OUT)
NetC13_2: C13.2 D7.A J12.1 REG2.2(OUT) REG2.4(OUT)

### Notes on the sheet
- VOLTAGE REGULATORS
- A 10 F ceramic or tantalum
  capacitor should be adequate
- Cout and its use is mandatory to ensure output
  stability. A minimum capacitance value of 4.7 F with an
  equivalent series resistance (ESR) that is within the limits of
  33 m (typ) to 2.2  is required

### Library data of the parts
C5-C13 = C_0603: D: *; MFR: *; P: *; PN: *; URL: *
D6 D7 = 1N4147: as D5 on sheet 3.Heater_and_Temperature_sensor; P: SOD123; URL: https://www.mouser.in/ProductDetail/Panjit/1N4148W_R2_00001?qs=sPbYRqrBIVlsNrvmMQOkFA%3D%3D
L1 = VLS6045EX-4R7M: MFR: TDK; D: Power Inductors - SMD 4.7 UH; PN: VLS6045EX-4R7M; P: *; URL: https://www.mouser.in/ProductDetail/TDK/VLS6045EX-4R7M?qs=GtmDRopnxzp2p1TJ0mf3tQ%3D%3D
R29 R30 = R_0603: D: *; MFR: *; P: *; PN: *; URL: *
REG1 = NCP1117ST50T3G: MFR: onsemi; P: SOT-223-3; D: LDO Voltage Regulators 5.0V 1A Positive; PN: NCP1117ST50T3G; URL: https://www.mouser.in/ProductDetail/onsemi/NCP1117ST50T3G?qs=Gev%252BmEvV0ib6dijy6U0dhQ%3D%3D
REG2 = NCP1117ST12T3G: MFR: onsemi; PN: NCP1117ST50T3G; D: LDO Voltage Regulators 12.0V 1A Positive; P: SOT-223; URL: https://www.mouser.in/ProductDetail/onsemi/NCP1117ST12T3G?qs=Gev%252BmEvV0iYlVubarTuj5w%3D%3D
U2 = AP63301/2: MFR: Diodes Incorporated; P: TSOT26; PN: AP63301WU-7; D: Switching Voltage Regulators DCDC Conv HV Buck TSOT26 T&R 3K; URL: https://www.mouser.in/ProductDetail/Diodes-Incorporated/AP63301WU-7?qs=bZr6mbWTK5mxozg17S0lNg%3D%3D

## Sheet 8.ESP32.SchDoc
size A4; SheetNumber: 9; SheetTotal: 13
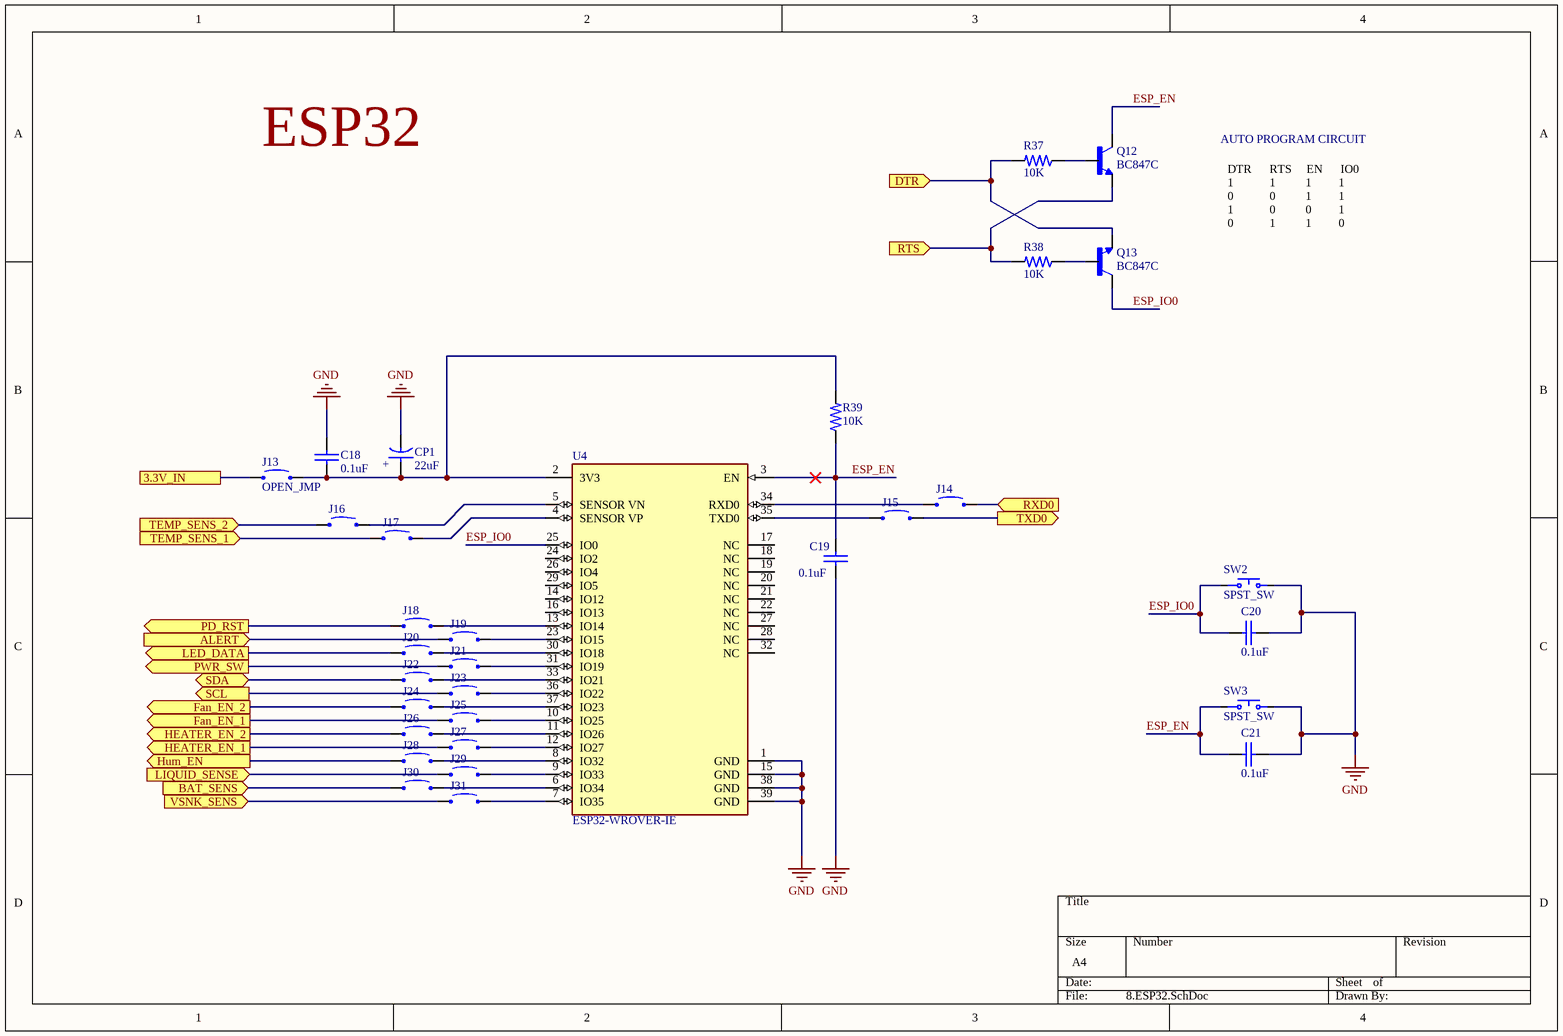
[diagram p10: 8.ESP32.SchDoc]

### Parts
C18  0.1uF  [C_0603]
C19  0.1uF  [C_0603]
C20  0.1uF  [C_0603]
C21  0.1uF  [C_0603]
CP1  22uF
J13  OPEN_JMP  [OPEN_JMP]
J14  OPEN_JMP  [OPEN_JMP]  (value not drawn)
J15  OPEN_JMP  [OPEN_JMP]  (value not drawn)
J16  OPEN_JMP  [OPEN_JMP]  (value not drawn)
J17  OPEN_JMP  [OPEN_JMP]  (value not drawn)
J18  OPEN_JMP  [OPEN_JMP]  (value not drawn)
J19  OPEN_JMP  [OPEN_JMP]  (value not drawn)
J20  OPEN_JMP  [OPEN_JMP]  (value not drawn)
J21  OPEN_JMP  [OPEN_JMP]  (value not drawn)
J22  OPEN_JMP  [OPEN_JMP]  (value not drawn)
J23  OPEN_JMP  [OPEN_JMP]  (value not drawn)
J24  OPEN_JMP  [OPEN_JMP]  (value not drawn)
J25  OPEN_JMP  [OPEN_JMP]  (value not drawn)
J26  OPEN_JMP  [OPEN_JMP]  (value not drawn)
J27  OPEN_JMP  [OPEN_JMP]  (value not drawn)
J28  OPEN_JMP  [OPEN_JMP]  (value not drawn)
J29  OPEN_JMP  [OPEN_JMP]  (value not drawn)
J30  OPEN_JMP  [OPEN_JMP]  (value not drawn)
J31  OPEN_JMP  [OPEN_JMP]  (value not drawn)
Q12  BC847C  [SOT-23-3]
Q13  BC847C  [SOT-23-3]
R37  10K  [R_0603]
R38  10K  [R_0603]
R39  10K  [R_0603]
SW2  SPST_SW  [PTS636 SM43J SMTR LFS]
SW3  SPST_SW  [PTS636 SM43J SMTR LFS]
U4  ESP32-WROVER-IE  [ESP32-WROVER-IE]

### Ports
3.3V_IN, ALERT (in), BAT_SENS (in), DTR (in), Fan_EN_1 (out), Fan_EN_2 (out), HEATER_EN_1 (out), HEATER_EN_2 (out), Hum_EN (out), LED_DATA (out), LIQUID_SENSE (in), PD_RST (out), PWR_SW (out), RTS (in), RXD0 (in), SCL (out), SDA (bidir), TEMP_SENS_1 (in), TEMP_SENS_2 (in), TXD0 (out), VSNK_SENS (in)

### Nets
GND: C18.2 C19.1 C20.1 C21.1 CP1.2 SW2.2(NO) SW3.2(NO) U4.1(GND) U4.15(GND) U4.38(GND) U4.39(GND)  [project net VSS]
3.3V: J13.1 ; port 3.3V_IN
ALERT: J19.1 ; port ALERT
BAT_SENS: J30.1 ; port BAT_SENS
DTR: Q13.2(E) R37.2 ; port DTR
ESP_EN: C19.2 C21.2 Q12.3(C) R39.1 SW3.1(COM) U4.3(EN)
ESP_IO0: C20.2 Q13.3(C) SW2.1(COM) U4.25(IO0)
FAN_EN_1: J25.1 ; port Fan_EN_1
FAN_EN_2: J24.1 ; port Fan_EN_2
HEATER_EN_1: J27.1 ; port HEATER_EN_1
HEATER_EN_2: J26.1 ; port HEATER_EN_2
HUM_EN: J28.1 ; port Hum_EN
LED_DATA: J20.1 ; port LED_DATA
LIQUID_SENSE: J29.1 ; port LIQUID_SENSE
PD_RST: J18.1 ; port PD_RST
PWR_SW: J21.1 ; port PWR_SW
RTS: Q12.2(E) R38.2 ; port RTS
RXD0: J14.2 ; port RXD0
SCL: J23.1 ; port SCL
SDA: J22.1 ; port SDA
TEMP_SENS_1: J17.1 ; port TEMP_SENS_1
TEMP_SENS_2: J16.1 ; port TEMP_SENS_2
TXD0: J15.2 ; port TXD0
VSNK_SENS: J31.1 ; port VSNK_SENS
NetC18_1: C18.1 CP1.1 J13.2 R39.2 U4.2(3V3)
NetJ14_1: J14.1 U4.34(RXD0)
NetJ15_1: J15.1 U4.35(TXD0)
NetJ16_2: J16.2 U4.5(SENSOR_VN)
NetJ17_2: J17.2 U4.4(SENSOR_VP)
NetJ18_2: J18.2 U4.13(IO14)
NetJ19_2: J19.2 U4.23(IO15)
NetJ20_2: J20.2 U4.30(IO18)
NetJ21_2: J21.2 U4.31(IO19)
NetJ22_2: J22.2 U4.33(IO21)
NetJ23_2: J23.2 U4.36(IO22)
NetJ24_2: J24.2 U4.37(IO23)
NetJ25_2: J25.2 U4.10(IO25)
NetJ26_2: J26.2 U4.11(IO26)
NetJ27_2: J27.2 U4.12(IO27)
NetJ28_2: J28.2 U4.8(IO32)
NetJ29_2: J29.2 U4.9(IO33)
NetJ30_2: J30.2 U4.6(IO34)
NetJ31_2: J31.2 U4.7(IO35)
NetQ12_1: Q12.1(B) R37.1
NetQ13_1: Q13.1(B) R38.1

Not connected (* = marked no-connect by the designer): U4 14(IO12) 16(IO13) 17(NC) 18(NC) 19(NC) 20(NC) 21(NC) 22(NC) 24(IO2) 26(IO4) 27(NC) 28(NC) 29(IO5) 32(NC)

### Notes on the sheet
- ESP32
- AUTO PROGRAM CIRCUIT
- DTR      RTS     EN      IO0                                                 1            1          1         1                                              0            0          1         1                                                   1            0          0         1                                        0            1          1         0
- (in symbol CP) +

### Library data of the parts
C18-C21 = C_0603: D: *; MFR: *; P: *; PN: *; URL: *
CP1 = CP
Q12 Q13 = BC847C: as Q4 on sheet 4.Power_switching; P: SOT-23-3; URL: https://www.mouser.in/ProductDetail/Nexperia/BC847C215?qs=me8TqzrmIYVnv3C18%2Fxa3Q%3D%3D
R37-R39 = R_0603: D: *; MFR: *; P: *; PN: *; URL: *
SW2 SW3 = SPST_SW: MFR: C&K; D: Tactile Switches Tact 50mA 12VDC, 6.0x3.5, 4.3mm H, 180gf, J leads, No ground pin, Black Actuator; PN: PTS636 SM43J SMTR LFS; P: *; URL: https://www.mouser.in/ProductDetail/CK/PTS636-SM43J-SMTR-LFS?qs=vLWxofP3U2wboJ6ciMafNg%3D%3D
U4 = ESP32-WROVER-IE: MFR: Espressif Systems; D: Multiprotocol Modules SMD Module ESP32-WROVER-IE, ESP32-D0WD-V3, 3.3V 64Mbit PSRAM, 16 MB SPI flash, IPEX connector; PN: ESP32-WROVER-IE-N16R8; P: *; URL: https://www.mouser.in/ProductDetail/Espressif-Systems/ESP32-WROVER-IE-N16R8?qs=sGAEpiMZZMu3sxpa5v1qrkR%2F6t0IkXq8TEHvlzz2yS8%3D

## Sheet 10.RGB_LED.SchDoc
size A4; SheetNumber: 11; SheetTotal: 13
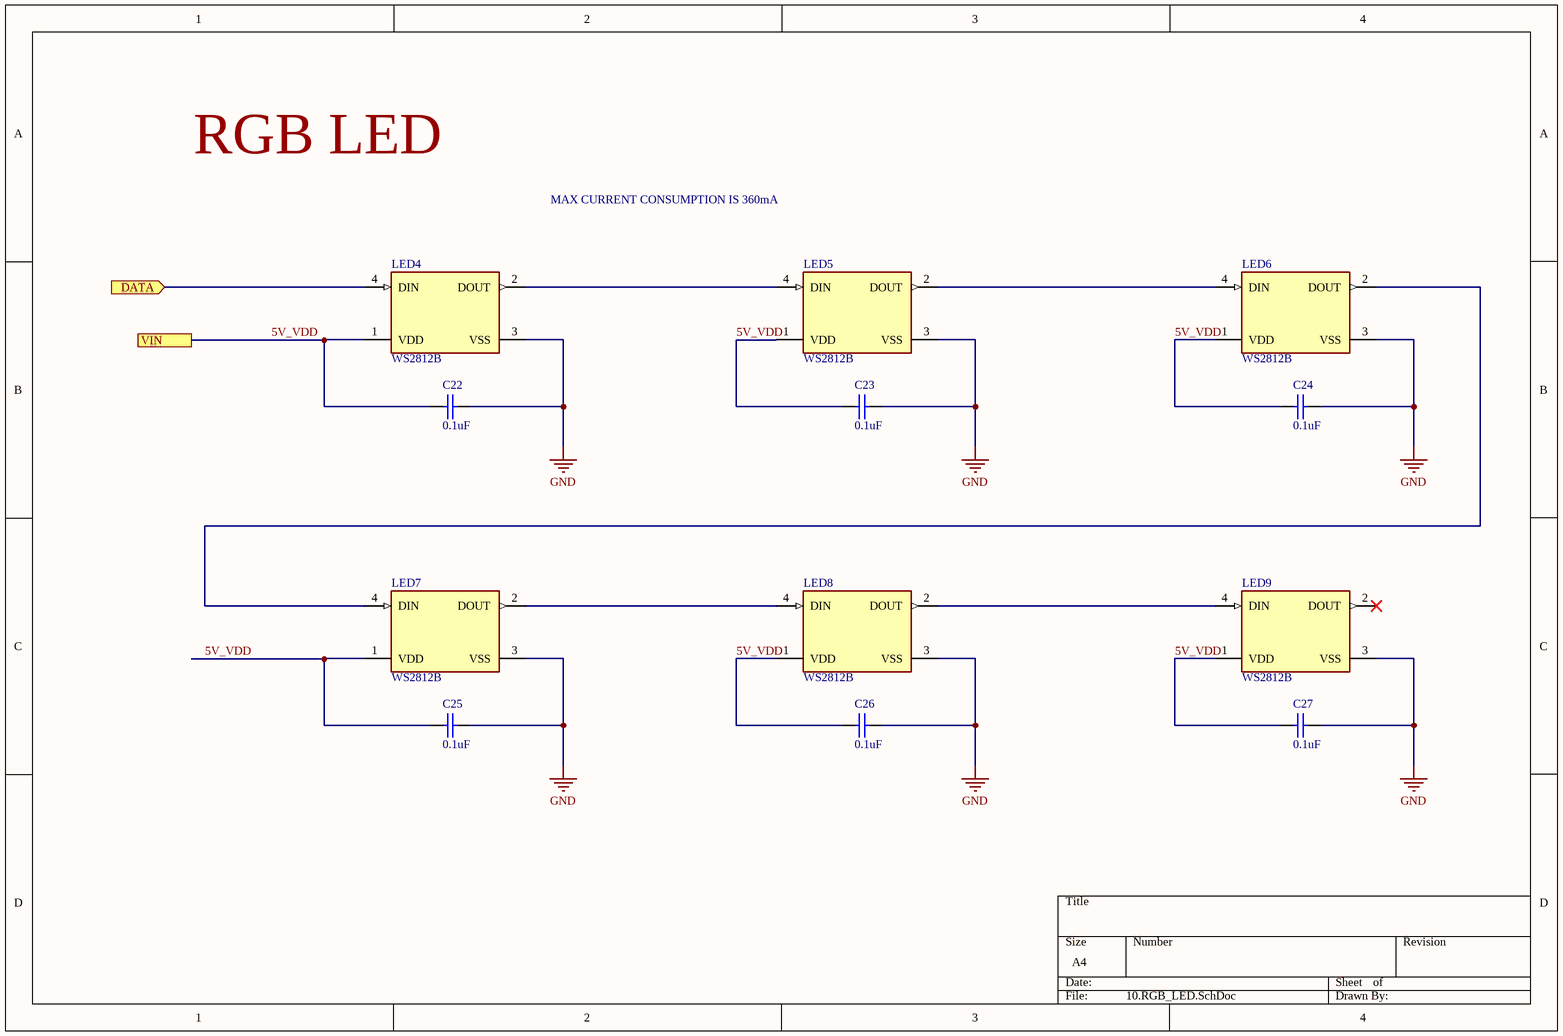
[diagram p11: 10.RGB_LED.SchDoc]

### Parts
C22  0.1uF  [C_0603]
C23  0.1uF  [C_0603]
C24  0.1uF  [C_0603]
C25  0.1uF  [C_0603]
C26  0.1uF  [C_0603]
C27  0.1uF  [C_0603]
LED4  WS2812B  [WS2812B]
LED5  WS2812B  [WS2812B]
LED6  WS2812B  [WS2812B]
LED7  WS2812B  [WS2812B]
LED8  WS2812B  [WS2812B]
LED9  WS2812B  [WS2812B]

### Ports
DATA (in), VIN

### Nets
GND: C22.1 C23.1 C24.1 C25.1 C26.1 C27.1 LED4.3(VSS) LED5.3(VSS) LED6.3(VSS) LED7.3(VSS) LED8.3(VSS) LED9.3(VSS)  [project net VSS]
5V_VDD: C22.2 C23.2 C24.2 C25.2 C26.2 C27.2 LED4.1(VDD) LED5.1(VDD) LED6.1(VDD) LED7.1(VDD) LED8.1(VDD) LED9.1(VDD) ; port VIN  [project net 5V]
LED_DATA: LED4.4(DIN) ; port DATA
NetLED4_2: LED4.2(DOUT) LED5.4(DIN)
NetLED5_2: LED5.2(DOUT) LED6.4(DIN)
NetLED6_2: LED6.2(DOUT) LED7.4(DIN)
NetLED7_2: LED7.2(DOUT) LED8.4(DIN)
NetLED8_2: LED8.2(DOUT) LED9.4(DIN)

Not connected (* = marked no-connect by the designer): LED9 2(DOUT)*

### Notes on the sheet
- RGB LED
- MAX CURRENT CONSUMPTION IS 360mA

### Library data of the parts
C22-C27 = C_0603: D: *; MFR: *; P: *; PN: *; URL: *

## Sheet 12.MCU.SchDoc
size A4; SheetNumber: 13; SheetTotal: 13
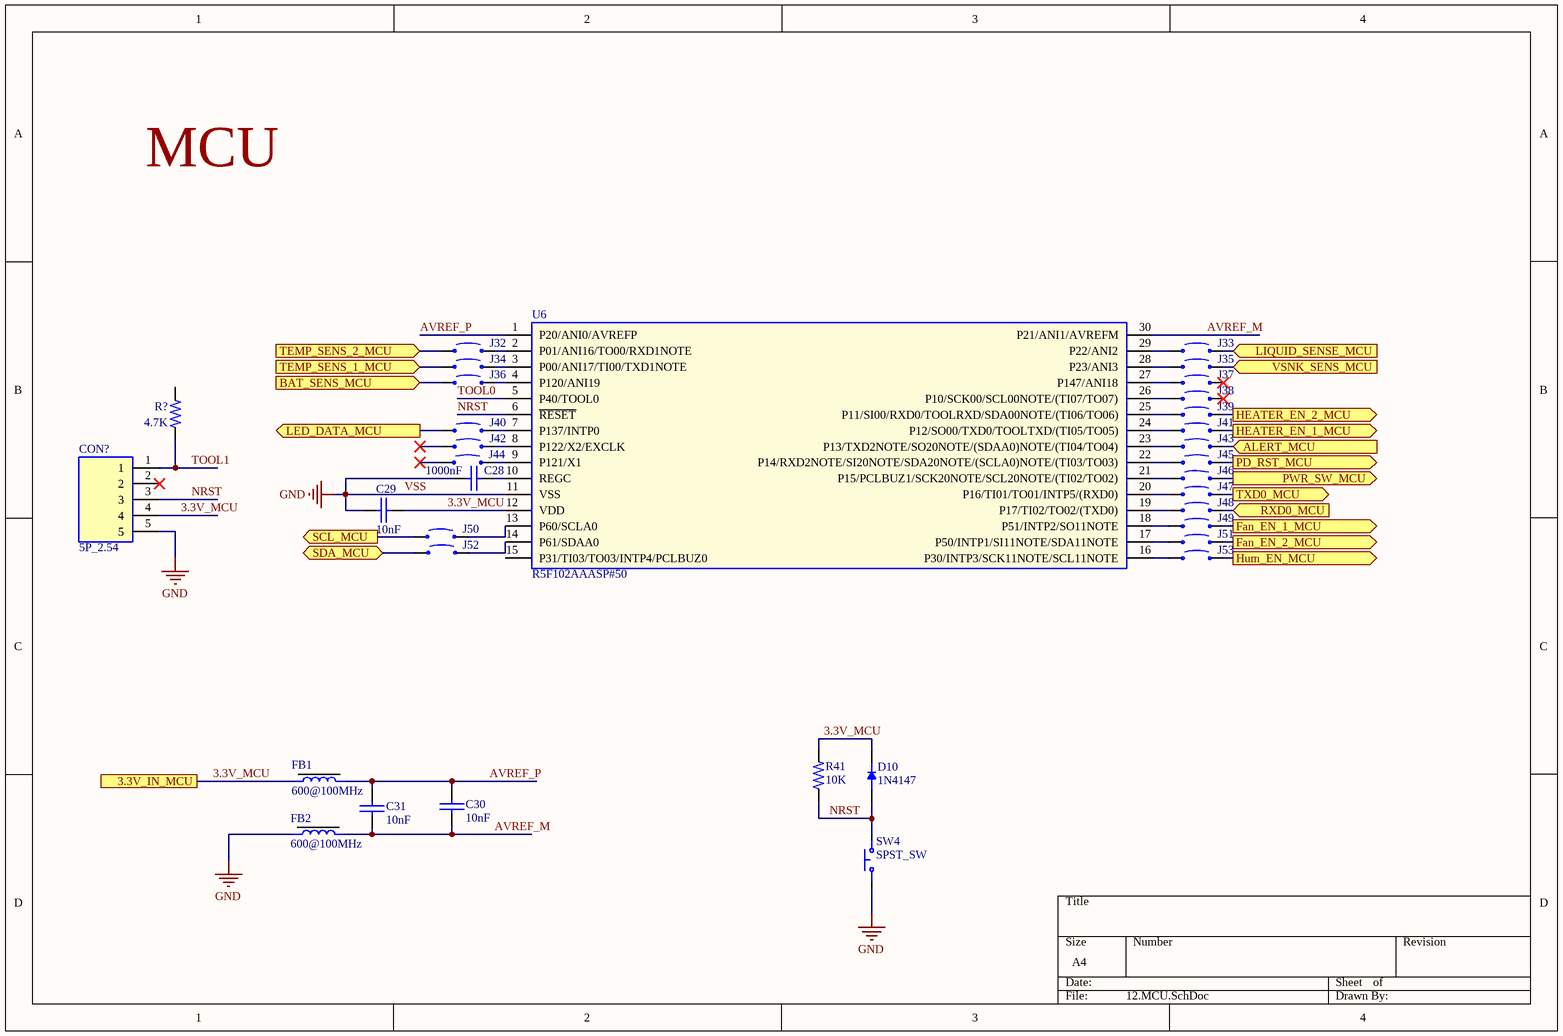
[diagram p12: 12.MCU.SchDoc]

### Parts
C28  1000nF  [C_0603]
C29  10nF  [C_0603]
C30  10nF  [C_0603]
C31  10nF  [C_0603]
CON?  5P_2.54  [5P2.54]
D10  1N4147  [SOD123]
FB1  600@100MHz  [FB0402]
FB2  600@100MHz  [FB0402]
J32  OPEN_JMP  [OPEN_JMP]  (value not drawn)
J33  OPEN_JMP  [OPEN_JMP]  (value not drawn)
J34  OPEN_JMP  [OPEN_JMP]  (value not drawn)
J35  OPEN_JMP  [OPEN_JMP]  (value not drawn)
J36  OPEN_JMP  [OPEN_JMP]  (value not drawn)
J37  OPEN_JMP  [OPEN_JMP]  (value not drawn)
J38  OPEN_JMP  [OPEN_JMP]  (value not drawn)
J39  OPEN_JMP  [OPEN_JMP]  (value not drawn)
J40  OPEN_JMP  [OPEN_JMP]  (value not drawn)
J41  OPEN_JMP  [OPEN_JMP]  (value not drawn)
J42  OPEN_JMP  [OPEN_JMP]  (value not drawn)
J43  OPEN_JMP  [OPEN_JMP]  (value not drawn)
J44  OPEN_JMP  [OPEN_JMP]  (value not drawn)
J45  OPEN_JMP  [OPEN_JMP]  (value not drawn)
J46  OPEN_JMP  [OPEN_JMP]  (value not drawn)
J47  OPEN_JMP  [OPEN_JMP]  (value not drawn)
J48  OPEN_JMP  [OPEN_JMP]  (value not drawn)
J49  OPEN_JMP  [OPEN_JMP]  (value not drawn)
J50  OPEN_JMP  [OPEN_JMP]  (value not drawn)
J51  OPEN_JMP  [OPEN_JMP]  (value not drawn)
J52  OPEN_JMP  [OPEN_JMP]  (value not drawn)
J53  OPEN_JMP  [OPEN_JMP]  (value not drawn)
R41  10K  [R_0603]
R?  4.7K  [R_0603]
SW4  SPST_SW  [PTS636 SM43J SMTR LFS]
U6  R5F102AAASP#50  [LSSOP-30]

### Ports
3.3V_IN_MCU, ALERT_MCU (in), BAT_SENS_MCU (in), Fan_EN_1_MCU (out), Fan_EN_2_MCU (out), HEATER_EN_1_MCU (out), HEATER_EN_2_MCU (out), Hum_EN_MCU (out), LED_DATA_MCU (out), LIQUID_SENSE_MCU (in), PD_RST_MCU (out), PWR_SW_MCU (out), RXD0_MCU (in), SCL_MCU (out), SDA_MCU (bidir), TEMP_SENS_1_MCU (in), TEMP_SENS_2_MCU (in), TXD0_MCU (out), VSNK_SENS_MCU (in)

### Nets
VSS: C28.1 C29.1 CON?.5 FB2.1 SW4.1(COM) U6.11(VSS)  [also labelled GND]
3.3V_MCU: C29.2 CON?.4 D10.C(K) FB1.1 R41.2 U6.12(VDD) ; port 3.3V_IN_MCU  [project net 3.3V]
ALERT: J43.2 ; port ALERT_MCU
AVREF_M: C30.1 C31.1 FB2.2 U6.30(P21/ANI1/AVREFM)
AVREF_P: C30.2 C31.2 FB1.2 U6.1(P20/ANI0/AVREFP)
BAT_SENS: J36.1 ; port BAT_SENS_MCU
FAN_EN_1: J49.2 ; port Fan_EN_1_MCU
FAN_EN_2: J51.2 ; port Fan_EN_2_MCU
HEATER_EN_1: J41.2 ; port HEATER_EN_1_MCU
HEATER_EN_2: J39.2 ; port HEATER_EN_2_MCU
HUM_EN: J53.2 ; port Hum_EN_MCU
LED_DATA: J40.1 ; port LED_DATA_MCU
LIQUID_SENSE: J33.2 ; port LIQUID_SENSE_MCU
NRST: CON?.3 D10.A R41.1 SW4.2(NO) U6.6(~{RESET})
PD_RST: J45.2 ; port PD_RST_MCU
PWR_SW: J46.2 ; port PWR_SW_MCU
RXD0: J47.2 ; port TXD0_MCU
SCL: J50.1 ; port SCL_MCU
SDA: J52.1 ; port SDA_MCU
TEMP_SENS_1: J34.1 ; port TEMP_SENS_1_MCU
TEMP_SENS_2: J32.1 ; port TEMP_SENS_2_MCU
TOOL0: U6.5(P40/TOOL0)
TOOL1: CON?.1 R?.1
TXD0: J48.2 ; port RXD0_MCU
VSNK_SENS: J35.2 ; port VSNK_SENS_MCU
NetC28_2: C28.2 U6.10(REGC)
NetJ32_2: J32.2 U6.2(P01/ANI16/TO00/RXD1NOTE)
NetJ33_1: J33.1 U6.29(P22/ANI2)
NetJ34_2: J34.2 U6.3(P00/ANI17/TI00/TXD1NOTE)
NetJ35_1: J35.1 U6.28(P23/ANI3)
NetJ36_2: J36.2 U6.4(P120/ANI19)
NetJ37_1: J37.1 U6.27(P147/ANI18)
NetJ38_1: J38.1 U6.26(P10/SCK00/SCL00NOTE/(TI07/TO07))
NetJ39_1: J39.1 U6.25(P11/SI00/RXD0/TOOLRXD/SDA00NOTE/(TI06/TO06))
NetJ40_2: J40.2 U6.7(P137/INTP0)
NetJ41_1: J41.1 U6.24(P12/SO00/TXD0/TOOLTXD/(TI05/TO05))
NetJ42_2: J42.2 U6.8(P122/X2/EXCLK)
NetJ43_1: J43.1 U6.23(P13/TXD2NOTE/SO20NOTE/(SDAA0)NOTE/(TI04/TO04))
NetJ44_2: J44.2 U6.9(P121/X1)
NetJ45_1: J45.1 U6.22(P14/RXD2NOTE/SI20NOTE/SDA20NOTE/(SCLA0)NOTE/(TI03/TO03))
NetJ46_1: J46.1 U6.21(P15/PCLBUZ1/SCK20NOTE/SCL20NOTE/(TI02/TO02))
NetJ47_1: J47.1 U6.20(P16/TI01/TO01/INTP5/(RXD0))
NetJ48_1: J48.1 U6.19(P17/TI02/TO02/(TXD0))
NetJ49_1: J49.1 U6.18(P51/INTP2/SO11NOTE)
NetJ50_2: J50.2 U6.13(P60/SCLA0)
NetJ51_1: J51.1 U6.17(P50/INTP1/SI11NOTE/SDA11NOTE)
NetJ52_2: J52.2 U6.14(P61/SDAA0)
NetJ53_1: J53.1 U6.16(P30/INTP3/SCK11NOTE/SCL11NOTE)

Not connected (* = marked no-connect by the designer): CON? 2*; J37 2*; J38 2*; J42 1*; J44 1*; R? 2; U6 15(P31/TI03/TO03/INTP4/PCLBUZ0)

### Notes on the sheet
- MCU

### Library data of the parts
C28-C31 = C_0603: D: *; MFR: *; P: *; PN: *; URL: *
CON? = 5P_2.54: PN: 87224-5
D10 = 1N4147: as D5 on sheet 3.Heater_and_Temperature_sensor; P: SOD123; URL: https://www.mouser.in/ProductDetail/Panjit/1N4148W_R2_00001?qs=sPbYRqrBIVlsNrvmMQOkFA%3D%3D
FB1 FB2 = FB0402: MFR: Murata Electronics; P: 0402; PN: BLM15HG601SN1D; D: Ferrite Beads 600 OHM 25%; URL: https://www.mouser.in/ProductDetail/Murata-Electronics/BLM15HG601SN1D?qs=0VEDk56ETTplQiBGmxjbtg%3D%3D
R41 R? = R_0603: D: *; MFR: *; P: *; PN: *; URL: *
SW4 = SPST_SW: as SW2 on sheet 8.ESP32; PN: PTS636 SM43J SMTR LFS; P: *; URL: https://www.mouser.in/ProductDetail/CK/PTS636-SM43J-SMTR-LFS?qs=vLWxofP3U2wboJ6ciMafNg%3D%3D
U6 = R5F102AAASP#50: MFR: Renesas Electronics; D: 16-bit Microcontrollers - MCU 16BIT MCU RL78/G12 16K 30LSSOP -40/+85C; PN: R5F102AAASP#50; P: LSSOP-30; URL: https://www.mouser.in/ProductDetail/Renesas-Electronics/R5F102AAASP50?qs=EBDBlbfErPyLiV42bLqAfw%3D%3D

## Nets that join several sheets
VSS: 1.USB_Power_Delivery (14 pins), 2.Connectors (CON2.4 CON4.2 CON4.4), U_3.Heater_and_Temperature_sensor (Q2A.3 R16A.1), U_3.Heater_and_Temperature_sensor (Q2B.3 R16B.1), 4.Power_switching (7 pins), 5.Battery (BAT1.1), 11.Air_Pressure_sensor (U5.1), 7.Humidifier (Q11.3 R33.1 R35.1), Fan (Q14A.3), 6.Voltage_regulators (11 pins), 8.ESP32 (11 pins), 10.RGB_LED (12 pins), Fan (Q14B.3), 12.MCU (6 pins)
3.3V: Main (R13.1 R14.1), 2.Connectors (CON2.1 CON4.3), U_3.Heater_and_Temperature_sensor (TR1A.1), U_3.Heater_and_Temperature_sensor (TR1B.1), 11.Air_Pressure_sensor (U5.2), 6.Voltage_regulators (J9.2), 8.ESP32 (J13.1), 12.MCU (6 pins)
5V: 2.Connectors (CON4.1), 7.Humidifier (IR1.A R31.2 U3.4 U3.8), 6.Voltage_regulators (J10.2), 10.RGB_LED (12 pins)
12V: Fan (D9A.C), 6.Voltage_regulators (J12.2), Fan (D9B.C)
20V: U_3.Heater_and_Temperature_sensor (CON5A.1 D5A.C), U_3.Heater_and_Temperature_sensor (CON5B.1 D5B.C), 4.Power_switching (9 pins), 7.Humidifier (D8.C L2.2), 6.Voltage_regulators (J11.1)
ALERT: 1.USB_Power_Delivery (U1.19), 8.ESP32 (J19.1), 12.MCU (J43.2)
BAT_OUT: 4.Power_switching (J7.1 SW1.1), 5.Battery (BAT1.2), 6.Voltage_regulators (J8.1)
BAT_SENS: 4.Power_switching (R19.1 R22.2), 8.ESP32 (J30.1), 12.MCU (J36.1)
DTR: 2.Connectors (CON3.4), 8.ESP32 (Q13.2 R37.2)
FAN_EN_1: Fan (R40A.1), 8.ESP32 (J25.1), 12.MCU (J49.2)
FAN_EN_2: 8.ESP32 (J24.1), Fan (R40B.1), 12.MCU (J51.2)
HEATER_EN_1: U_3.Heater_and_Temperature_sensor (R15A.1), 8.ESP32 (J27.1), 12.MCU (J41.2)
HEATER_EN_2: U_3.Heater_and_Temperature_sensor (R15B.1), 8.ESP32 (J26.1), 12.MCU (J39.2)
HUM_EN: 7.Humidifier (R36.1), 8.ESP32 (J28.1), 12.MCU (J53.2)
LED_DATA: 8.ESP32 (J20.1), 10.RGB_LED (LED4.4), 12.MCU (J40.1)
LIQUID_SENSE: 7.Humidifier (IR1.E R35.2 TP3.1), 8.ESP32 (J29.1), 12.MCU (J33.2)
NetJ1_2: 1.USB_Power_Delivery (J1.2), 4.Power_switching (6 pins)
PD_RST: 1.USB_Power_Delivery (R10.2 U1.6), 8.ESP32 (J18.1), 12.MCU (J45.2)
PWR_SW: 4.Power_switching (R20.2 R24.2 R25.2 R28.2), 8.ESP32 (J21.1), 12.MCU (J46.2)
RTS: 2.Connectors (CON3.1), 8.ESP32 (Q12.2 R38.2)
RXD0: 2.Connectors (CON3.2), 8.ESP32 (J14.2), 12.MCU (J47.2)
SCL: Main (R14.2), 1.USB_Power_Delivery (U1.7), 2.Connectors (CON2.2), 11.Air_Pressure_sensor (U5.4), 8.ESP32 (J23.1), 12.MCU (J50.1)
SDA: Main (R13.2), 1.USB_Power_Delivery (U1.8), 2.Connectors (CON2.3), 11.Air_Pressure_sensor (U5.3), 8.ESP32 (J22.1), 12.MCU (J52.1)
TEMP_SENS_1: U_3.Heater_and_Temperature_sensor (R16A.2 TR1A.2), 8.ESP32 (J17.1), 12.MCU (J34.1)
TEMP_SENS_2: U_3.Heater_and_Temperature_sensor (R16B.2 TR1B.2), 8.ESP32 (J16.1), 12.MCU (J32.1)
TXD0: 2.Connectors (CON3.3), 8.ESP32 (J15.2), 12.MCU (J48.2)
VSNK_SENS: 4.Power_switching (R18.1 R21.2), 8.ESP32 (J31.1), 12.MCU (J35.2)